# Altium project MD2084-R3M2E2.PrjPcb (part 1 of 3)
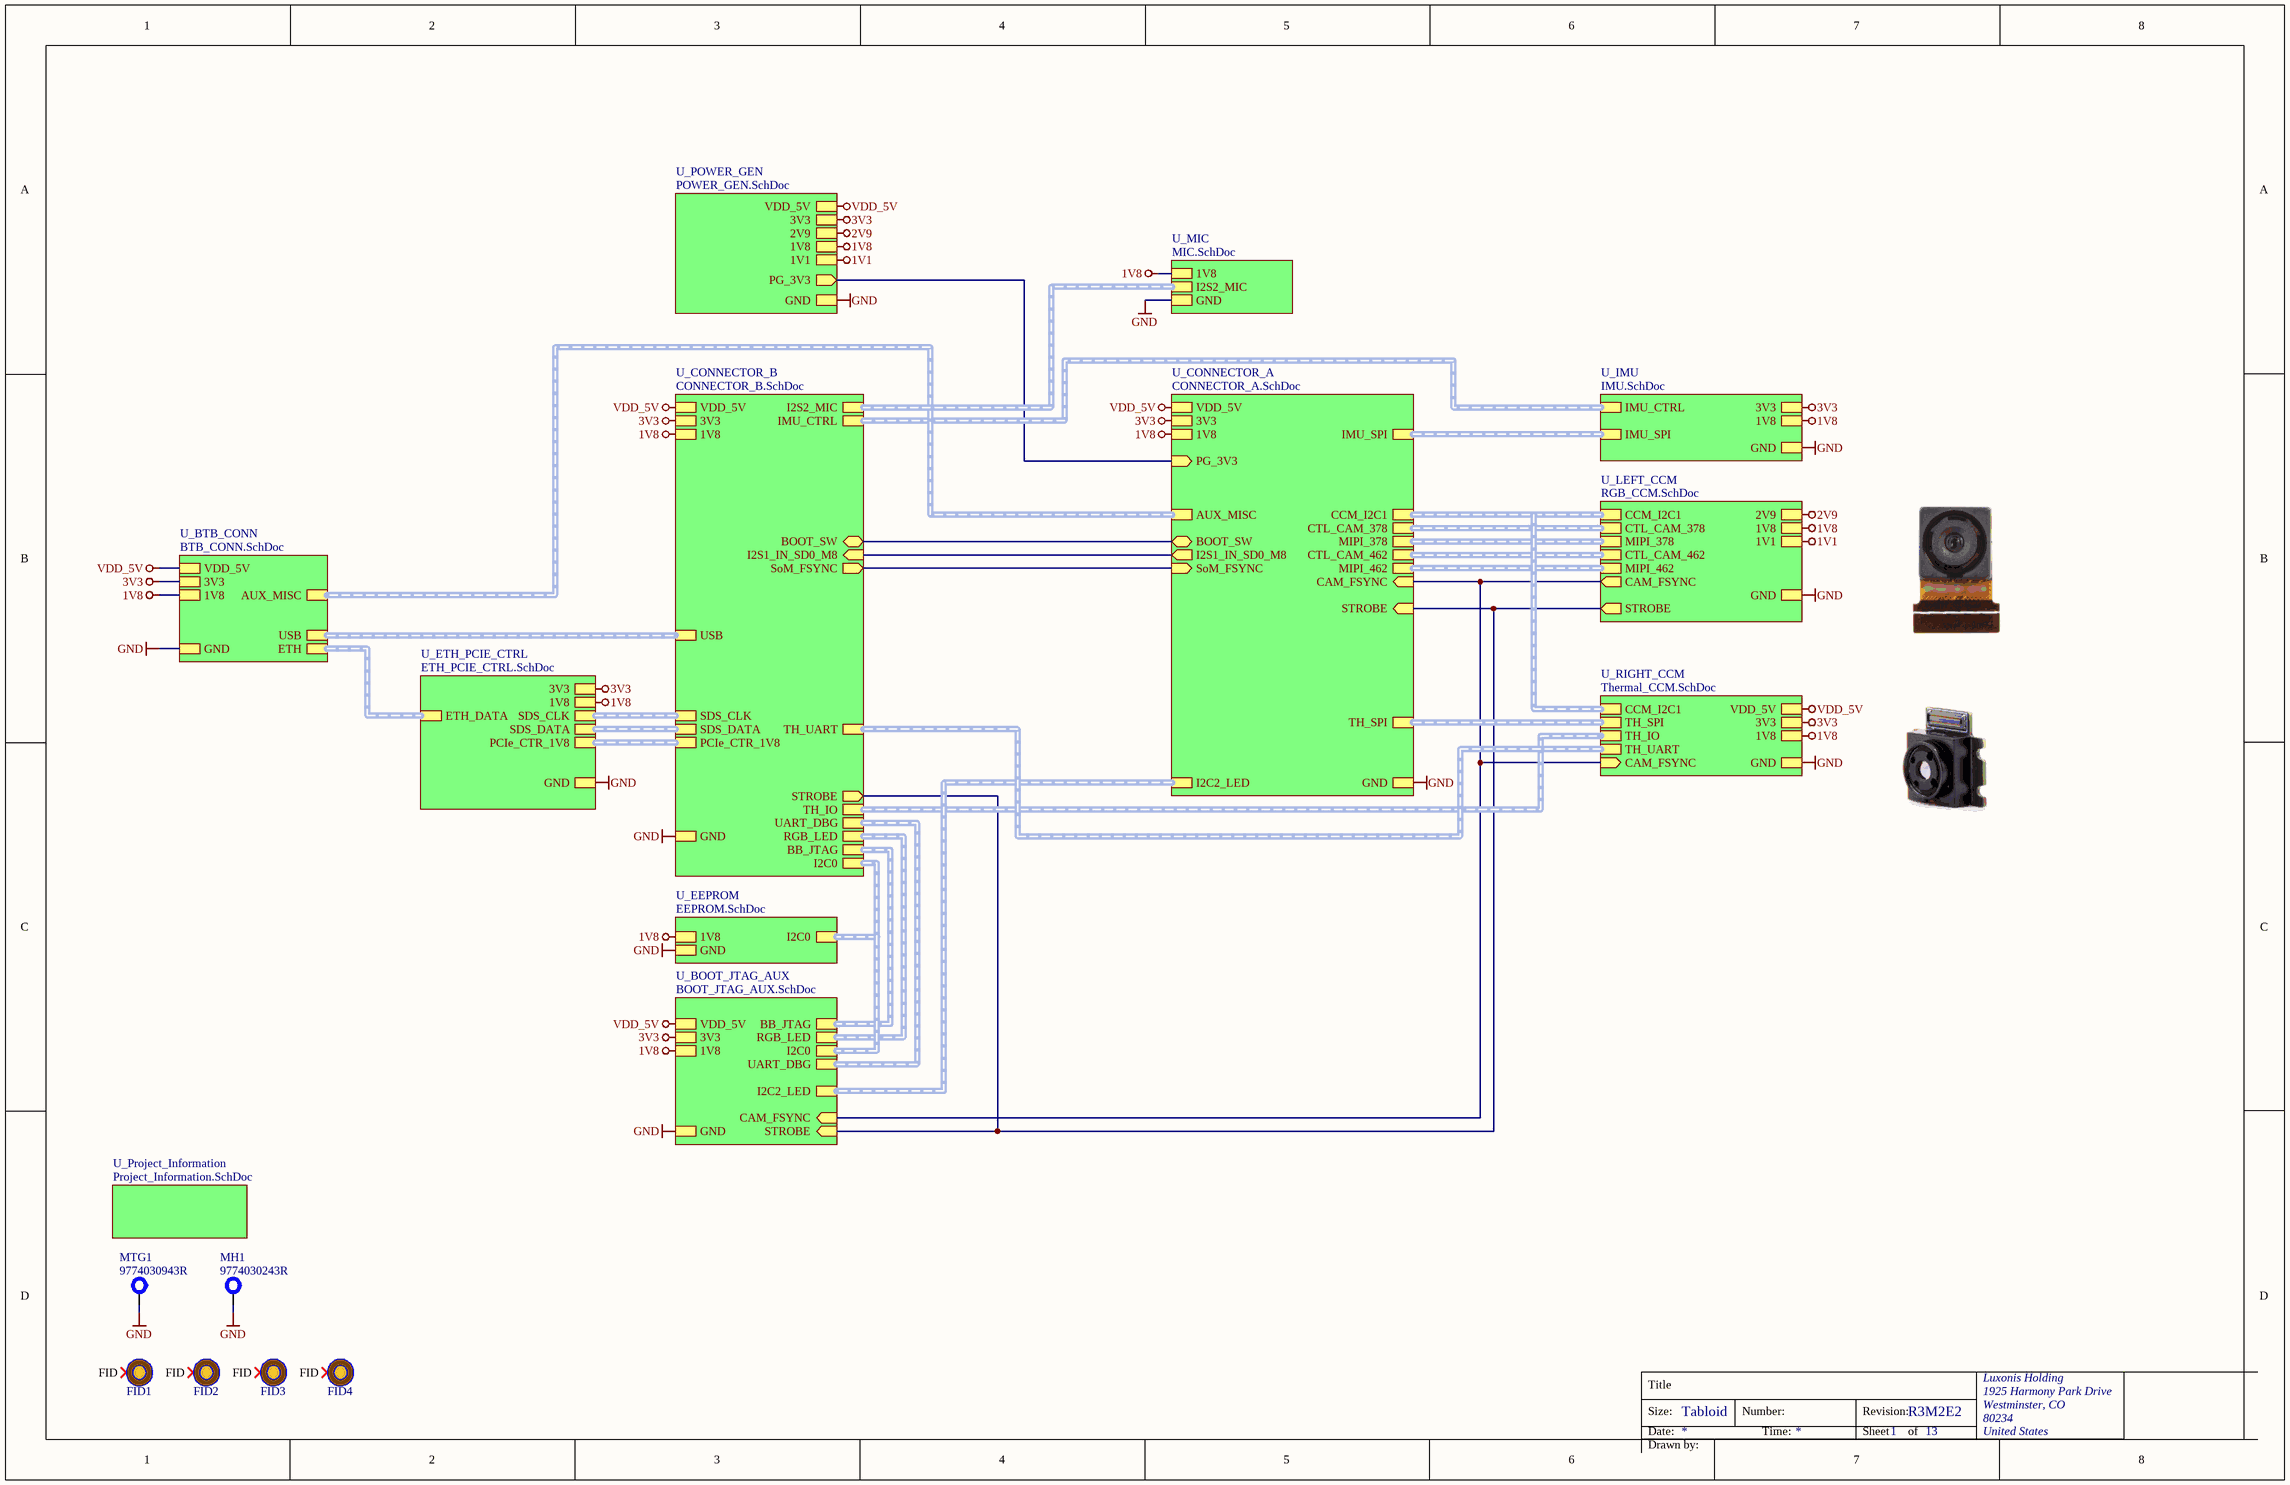
[diagram p0: TopLevel.SchDoc]
revision: R3M2E2; project_title: MD2084; drawn_by: Martin Debevc; document_number: D2088000
13 sheets, 246 parts. Net scope: strictly hierarchical (ports join the sheet entries above them; power ports are local).
Board file: MD2084.PcbDoc
Sheets:
  TopLevel.SchDoc
    U_Project_Information = Project_Information.SchDoc
    U_CONNECTOR_B = CONNECTOR_B.SchDoc
    U_CONNECTOR_A = CONNECTOR_A.SchDoc
    U_ETH_PCIE_CTRL = ETH_PCIE_CTRL.SchDoc
    U_BOOT_JTAG_AUX = BOOT_JTAG_AUX.SchDoc
    U_POWER_GEN = POWER_GEN.SchDoc
    U_RIGHT_CCM = Thermal_CCM.SchDoc
    U_LEFT_CCM = RGB_CCM.SchDoc
    U_IMU = IMU.SchDoc
    U_EEPROM = EEPROM.SchDoc
    U_BTB_CONN = BTB_CONN.SchDoc
    U_MIC = MIC.SchDoc

## Sheet TopLevel.SchDoc: =project_title
size Tabloid; CompanyName: Luxonis Holding; DrawnBy: Martin Debevc; Organization: Luxonis Holding; Address1: 1925 Harmony Park Drive; Address2: Westminster, CO; Address3: 80234; Address4: United States; DocumentNumber: D2088000; Revision: R3M2E2; SheetNumber: 1; SheetTotal: 13

### Parts
FID1  FIDUCIAL  [FIDUCIAL_ROUND_1MM]  (value not drawn)  (no BOM)
FID2  FIDUCIAL  [FIDUCIAL_ROUND_1MM]  (value not drawn)  (no BOM)
FID3  FIDUCIAL  [FIDUCIAL_ROUND_1MM]  (value not drawn)  (no BOM)
FID4  FIDUCIAL  [FIDUCIAL_ROUND_1MM]  (value not drawn)  (no BOM)
MH1  9774030243R  [9774030243R]
MTG1  9774030943R  [9774030943R]

### Sub-sheets
U_BOOT_JTAG_AUX = BOOT_JTAG_AUX.SchDoc: RGB_LED (harness RGB_LED), BB_JTAG (harness BB_JTAG), 1V8, 3V3, VDD_5V, STROBE (in), GND, I2C0 (harness I2C0), UART_DBG (harness UART_DEBUG), CAM_FSYNC (in), I2C2_LED (harness I2C2)
U_BTB_CONN = BTB_CONN.SchDoc: GND, VDD_5V, 3V3, USB (harness USB), 1V8, AUX_MISC (harness AUX_MISC), ETH (harness ETH_DATA)
U_CONNECTOR_A = CONNECTOR_A.SchDoc: GND, PG_3V3 (in), 3V3, 1V8, VDD_5V, MIPI_462 (harness MIPI_462), AUX_MISC (harness AUX_MISC), BOOT_SW (bidir), STROBE (in), CAM_FSYNC (in), IMU_SPI (harness IMU_SPI), TH_SPI (harness TH_SPI), CCM_I2C1 (harness I2C1), CTL_CAM_378 (harness CTL_CAM_378), MIPI_378 (harness MIPI_378), CTL_CAM_462 (harness CTL_CAM_462), I2S1_IN_SD0_M8 (out), I2C2_LED (harness I2C2), SoM_FSYNC (in)
U_CONNECTOR_B = CONNECTOR_B.SchDoc: VDD_5V, RGB_LED (harness RGB_LED), 1V8, GND, 3V3, I2C0 (harness I2C0), BB_JTAG (harness BB_JTAG), USB (harness USB), BOOT_SW (bidir), UART_DBG (harness UART_DEBUG), IMU_CTRL (harness IMU_CTRL), SDS_CLK (harness SDS_CLK), SDS_DATA (harness SDS_DATA), PCIe_CTR_1V8 (harness PCIe_CTR_1V8), I2S1_IN_SD0_M8 (in), TH_IO (harness TH_IO), STROBE (out), TH_UART (harness UART), I2S2_MIC (harness I2S2_MIC), SoM_FSYNC (out)
U_EEPROM = EEPROM.SchDoc: 1V8, GND, I2C0 (harness I2C0)
U_ETH_PCIE_CTRL = ETH_PCIE_CTRL.SchDoc: 3V3, GND, ETH_DATA (harness ETH_DATA), SDS_DATA (harness SDS_DATA), SDS_CLK (harness SDS_CLK), PCIe_CTR_1V8 (harness PCIe_CTR_1V8), 1V8
U_IMU = IMU.SchDoc: 3V3, 1V8, GND, IMU_SPI (harness IMU_SPI), IMU_CTRL (harness IMU_CTRL)
U_LEFT_CCM = RGB_CCM.SchDoc: GND, 1V8, 1V1, MIPI_462 (harness MIPI_462), MIPI_378 (harness MIPI_378), 2V9, STROBE (out), CTL_CAM_378 (harness CTL_CAM_RGB), CTL_CAM_462 (harness CTL_CAM_RGB), CAM_FSYNC (out), CCM_I2C1 (harness I2C1)
U_MIC = MIC.SchDoc: 1V8, GND, I2S2_MIC (harness I2S2_MIC)
U_POWER_GEN = POWER_GEN.SchDoc: GND, 3V3, 1V8, VDD_5V, 1V1, PG_3V3 (out), 2V9
U_Project_Information = Project_Information.SchDoc: no entries
U_RIGHT_CCM = Thermal_CCM.SchDoc: GND, 3V3, VDD_5V, 1V8, TH_SPI (harness TH_SPI), TH_IO (harness TH_IO), CCM_I2C1 (harness I2C1), TH_UART (harness UART), CAM_FSYNC (in)

### Nets
1V1: sheet U_POWER_GEN/1V1, sheet U_LEFT_CCM/1V1
1V8: sheet U_CONNECTOR_B/1V8, sheet U_CONNECTOR_A/1V8, sheet U_ETH_PCIE_CTRL/1V8, sheet U_BOOT_JTAG_AUX/1V8, sheet U_POWER_GEN/1V8, sheet U_RIGHT_CCM/1V8, sheet U_LEFT_CCM/1V8, sheet U_IMU/1V8, sheet U_EEPROM/1V8, sheet U_BTB_CONN/1V8, sheet U_MIC/1V8
2V9: sheet U_POWER_GEN/2V9, sheet U_LEFT_CCM/2V9
3V3: sheet U_CONNECTOR_B/3V3, sheet U_CONNECTOR_A/3V3, sheet U_ETH_PCIE_CTRL/3V3, sheet U_BOOT_JTAG_AUX/3V3, sheet U_POWER_GEN/3V3, sheet U_RIGHT_CCM/3V3, sheet U_IMU/3V3, sheet U_BTB_CONN/3V3
GND: MH1.1 MTG1.1 ; sheet U_CONNECTOR_B/GND, sheet U_CONNECTOR_A/GND, sheet U_ETH_PCIE_CTRL/GND, sheet U_BOOT_JTAG_AUX/GND, sheet U_POWER_GEN/GND, sheet U_RIGHT_CCM/GND, sheet U_LEFT_CCM/GND, sheet U_IMU/GND, sheet U_EEPROM/GND, sheet U_BTB_CONN/GND, sheet U_MIC/GND
VDD_5V: sheet U_CONNECTOR_B/VDD_5V, sheet U_CONNECTOR_A/VDD_5V, sheet U_BOOT_JTAG_AUX/VDD_5V, sheet U_POWER_GEN/VDD_5V, sheet U_RIGHT_CCM/VDD_5V, sheet U_BTB_CONN/VDD_5V
BOOT_SW: sheet U_CONNECTOR_B/BOOT_SW, sheet U_CONNECTOR_A/BOOT_SW
CAM_FSYNC: sheet U_CONNECTOR_A/CAM_FSYNC, sheet U_BOOT_JTAG_AUX/CAM_FSYNC, sheet U_RIGHT_CCM/CAM_FSYNC, sheet U_LEFT_CCM/CAM_FSYNC
I2S1_IN_SD0_M8: sheet U_CONNECTOR_B/I2S1_IN_SD0_M8, sheet U_CONNECTOR_A/I2S1_IN_SD0_M8
PG_3V3: sheet U_CONNECTOR_A/PG_3V3, sheet U_POWER_GEN/PG_3V3
SoM_FSYNC: sheet U_CONNECTOR_B/SoM_FSYNC, sheet U_CONNECTOR_A/SoM_FSYNC
STROBE: sheet U_CONNECTOR_B/STROBE, sheet U_CONNECTOR_A/STROBE, sheet U_BOOT_JTAG_AUX/STROBE, sheet U_LEFT_CCM/STROBE

Not connected (* = marked no-connect by the designer): FID1 FID*; FID2 FID*; FID3 FID*; FID4 FID*

### Buses and harness runs
harness sheet U_BOOT_JTAG_AUX/BB_JTAG = sheet U_CONNECTOR_B/BB_JTAG
harness sheet U_BOOT_JTAG_AUX/I2C0 = sheet U_CONNECTOR_B/I2C0 = sheet U_EEPROM/I2C0
harness sheet U_BOOT_JTAG_AUX/I2C2_LED = sheet U_CONNECTOR_A/I2C2_LED
harness sheet U_BOOT_JTAG_AUX/RGB_LED = sheet U_CONNECTOR_B/RGB_LED
harness sheet U_BOOT_JTAG_AUX/UART_DBG = sheet U_CONNECTOR_B/UART_DBG
harness sheet U_BTB_CONN/AUX_MISC = sheet U_CONNECTOR_A/AUX_MISC
harness sheet U_BTB_CONN/ETH = sheet U_ETH_PCIE_CTRL/ETH_DATA
harness sheet U_BTB_CONN/USB = sheet U_CONNECTOR_B/USB
harness sheet U_CONNECTOR_A/CCM_I2C1 = sheet U_LEFT_CCM/CCM_I2C1 = sheet U_RIGHT_CCM/CCM_I2C1
harness sheet U_CONNECTOR_A/CTL_CAM_378 = sheet U_LEFT_CCM/CTL_CAM_378
harness sheet U_CONNECTOR_A/CTL_CAM_462 = sheet U_LEFT_CCM/CTL_CAM_462
harness sheet U_CONNECTOR_A/IMU_SPI = sheet U_IMU/IMU_SPI
harness sheet U_CONNECTOR_A/MIPI_378 = sheet U_LEFT_CCM/MIPI_378
harness sheet U_CONNECTOR_A/MIPI_462 = sheet U_LEFT_CCM/MIPI_462
harness sheet U_CONNECTOR_A/TH_SPI = sheet U_RIGHT_CCM/TH_SPI
harness sheet U_CONNECTOR_B/I2S2_MIC = sheet U_MIC/I2S2_MIC
harness sheet U_CONNECTOR_B/IMU_CTRL = sheet U_IMU/IMU_CTRL
harness sheet U_CONNECTOR_B/PCIe_CTR_1V8 = sheet U_ETH_PCIE_CTRL/PCIe_CTR_1V8
harness sheet U_CONNECTOR_B/SDS_CLK = sheet U_ETH_PCIE_CTRL/SDS_CLK
harness sheet U_CONNECTOR_B/SDS_DATA = sheet U_ETH_PCIE_CTRL/SDS_DATA
harness sheet U_CONNECTOR_B/TH_IO = sheet U_RIGHT_CCM/TH_IO
harness sheet U_CONNECTOR_B/TH_UART = sheet U_RIGHT_CCM/TH_UART

### Notes on the sheet
- Title
- Size:
- Date:
- Tabloid
- Number:
- Time:
- Revision:
- Sheet
- of
- Drawn by:

### Library data of the parts
FID1-FID4 = CMP-011-000000-4: Fiducial with various available footprints; Manufacturer Part Number 1: /
MH1 = CMP-014-000015-1: MP ROUND STANDOFF M2X0.4 STEEL 3MM; Manufacturer 1: Wurth Electronics; Plating: Tin; Outside Diameter: 0.171inch; Threaded/Unthreaded: Threaded; RoHS: Yes; Pricing 1: 1=0.95000, 10=0.91800, 50=0.79500, 100=0.73900 (USD); ComponentLink1URL: http://www.mouser.com/ds/2/445/9774030243R-611455.pdf?src-supplier=Mouser; ComponentLink1Description: http://www.mouser.com/ds/2/445/9774030243R-611455.pdf?src-supplier=Mouser; Material: Steel; REACH SVHC: Unknown; Length: 0.173inch; ComponentLink4Description: http://www.farnell.com/datasheets/1960368.pdf?src-supplier=Newark; ComponentLink3Description: https://katalog.we-online.de/em/datasheet/9774030243R.pdf?src-supplier=Digi-Key; Stock 1: 20568; ComponentLink5URL: http://www.farnell.com/datasheets/1960368.pdf?src-supplier=Element14; ComponentLink3URL: https://katalog.we-online.de/em/datasheet/9774030243R.pdf?src-supplier=Digi-Key; ComponentLink2Description: http://www.farnell.com/datasheets/1960368.pdf?src-supplier=Farnell; ComponentLink4URL: http://www.farnell.com/datasheets/1960368.pdf?src-supplier=Newark; Source: LuxonisMaster.SchLib; Manufacturer Part Number 1: 9774030243R; Design Item ID: 9774030243R; ComponentLink2URL: http://www.farnell.com/datasheets/1960368.pdf?src-supplier=Farnell; ComponentLink5Description: http://www.farnell.com/datasheets/1960368.pdf?src-supplier=Element14
MTG1 = CMP-090-000000-4: Spacers/Standoffs; Manufacturer 1: Wurth Electronics; Manufacturer Part Number 1: 9774030943R

## Sheet Project_Information.SchDoc: =project_title
size Tabloid; CompanyName: Luxonis Holding; DrawnBy: Martin Debevc; Organization: Luxonis Holding; Address1: 1925 Harmony Park Drive; Address2: Westminster, CO; Address3: 80234; Address4: United States; DocumentNumber: D2088000; Revision: R3M2E2; SheetNumber: 2; SheetTotal: 13
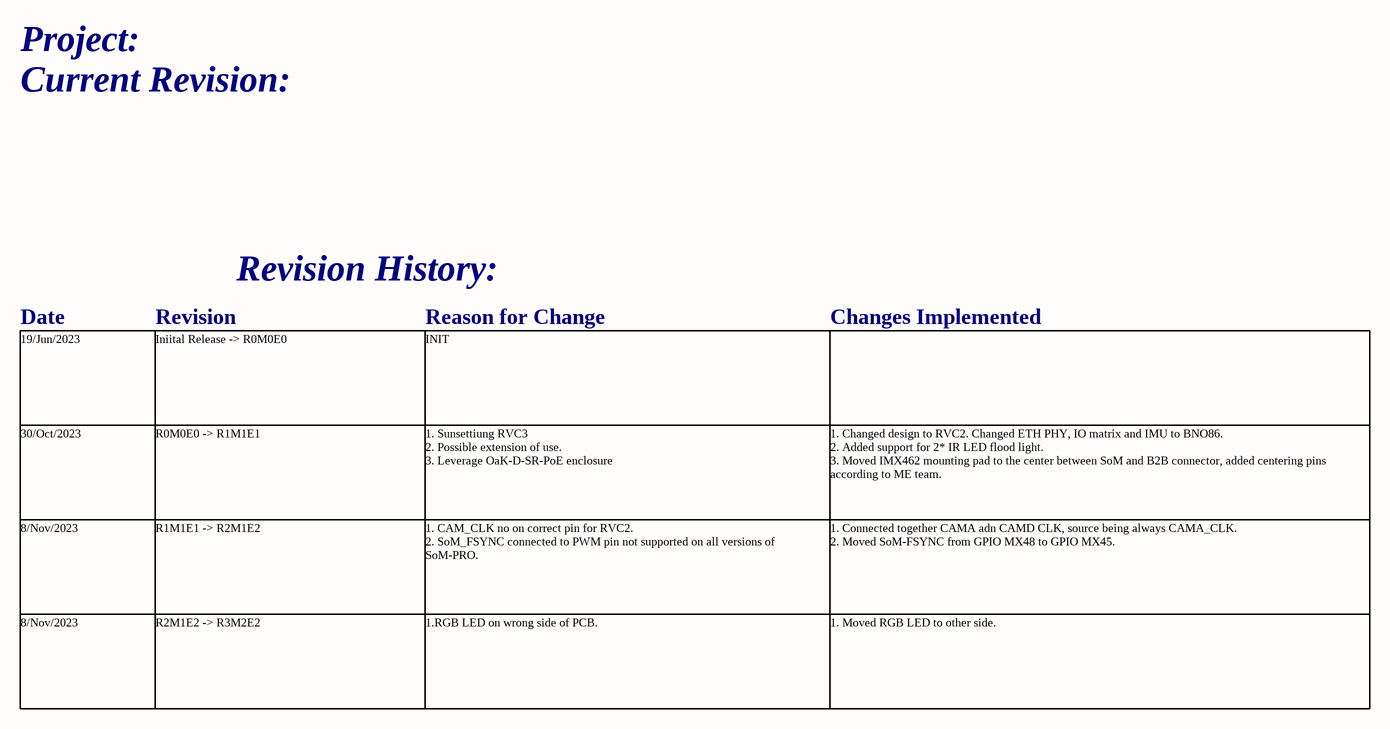
[diagram p1: Project_Information.SchDoc]

### Notes on the sheet
- Project:
- Current Revision:
- Revision History:
- Date
- Revision
- Reason for Change
- Changes Implemented
- 19/Jun/2023
- Iniital Release -> R0M0E0
- INIT
- 30/Oct/2023
- R0M0E0 -> R1M1E1
- 1. Sunsettiung RVC3
  2. Possible extension of use.
  3. Leverage OaK-D-SR-PoE enclosure
- 1. Changed design to RVC2. Changed ETH PHY, IO matrix and IMU to BNO86.
  2. Added support for 2* IR LED flood light.
  3. Moved IMX462 mounting pad to the center between SoM and B2B connector, added centering pins according to ME team.
- 8/Nov/2023
- R1M1E1 -> R2M1E2
- 1. CAM_CLK no on correct pin for RVC2.
  2. SoM_FSYNC connected to PWM pin not supported on all versions of SoM-PRO.
- 1. Connected together CAMA adn CAMD CLK, source being always CAMA_CLK.
  2. Moved SoM-FSYNC from GPIO MX48 to GPIO MX45.
- R2M1E2 -> R3M2E2
- 1.RGB LED on wrong side of PCB.
- 1. Moved RGB LED to other side.
- Title
- Size:
- Date:
- Tabloid
- Number:
- Time:
- Revision:
- Sheet
- of
- Drawn by:

## Sheet CONNECTOR_B.SchDoc: =project_title
size Tabloid; CompanyName: Luxonis Holding; DrawnBy: Martin Debevc; Organization: Luxonis Holding; Address1: 1925 Harmony Park Drive; Address2: Westminster, CO; Address3: 80234; Address4: United States; DocumentNumber: D2088000; Revision: R3M2E2; SheetNumber: 6; SheetTotal: 13
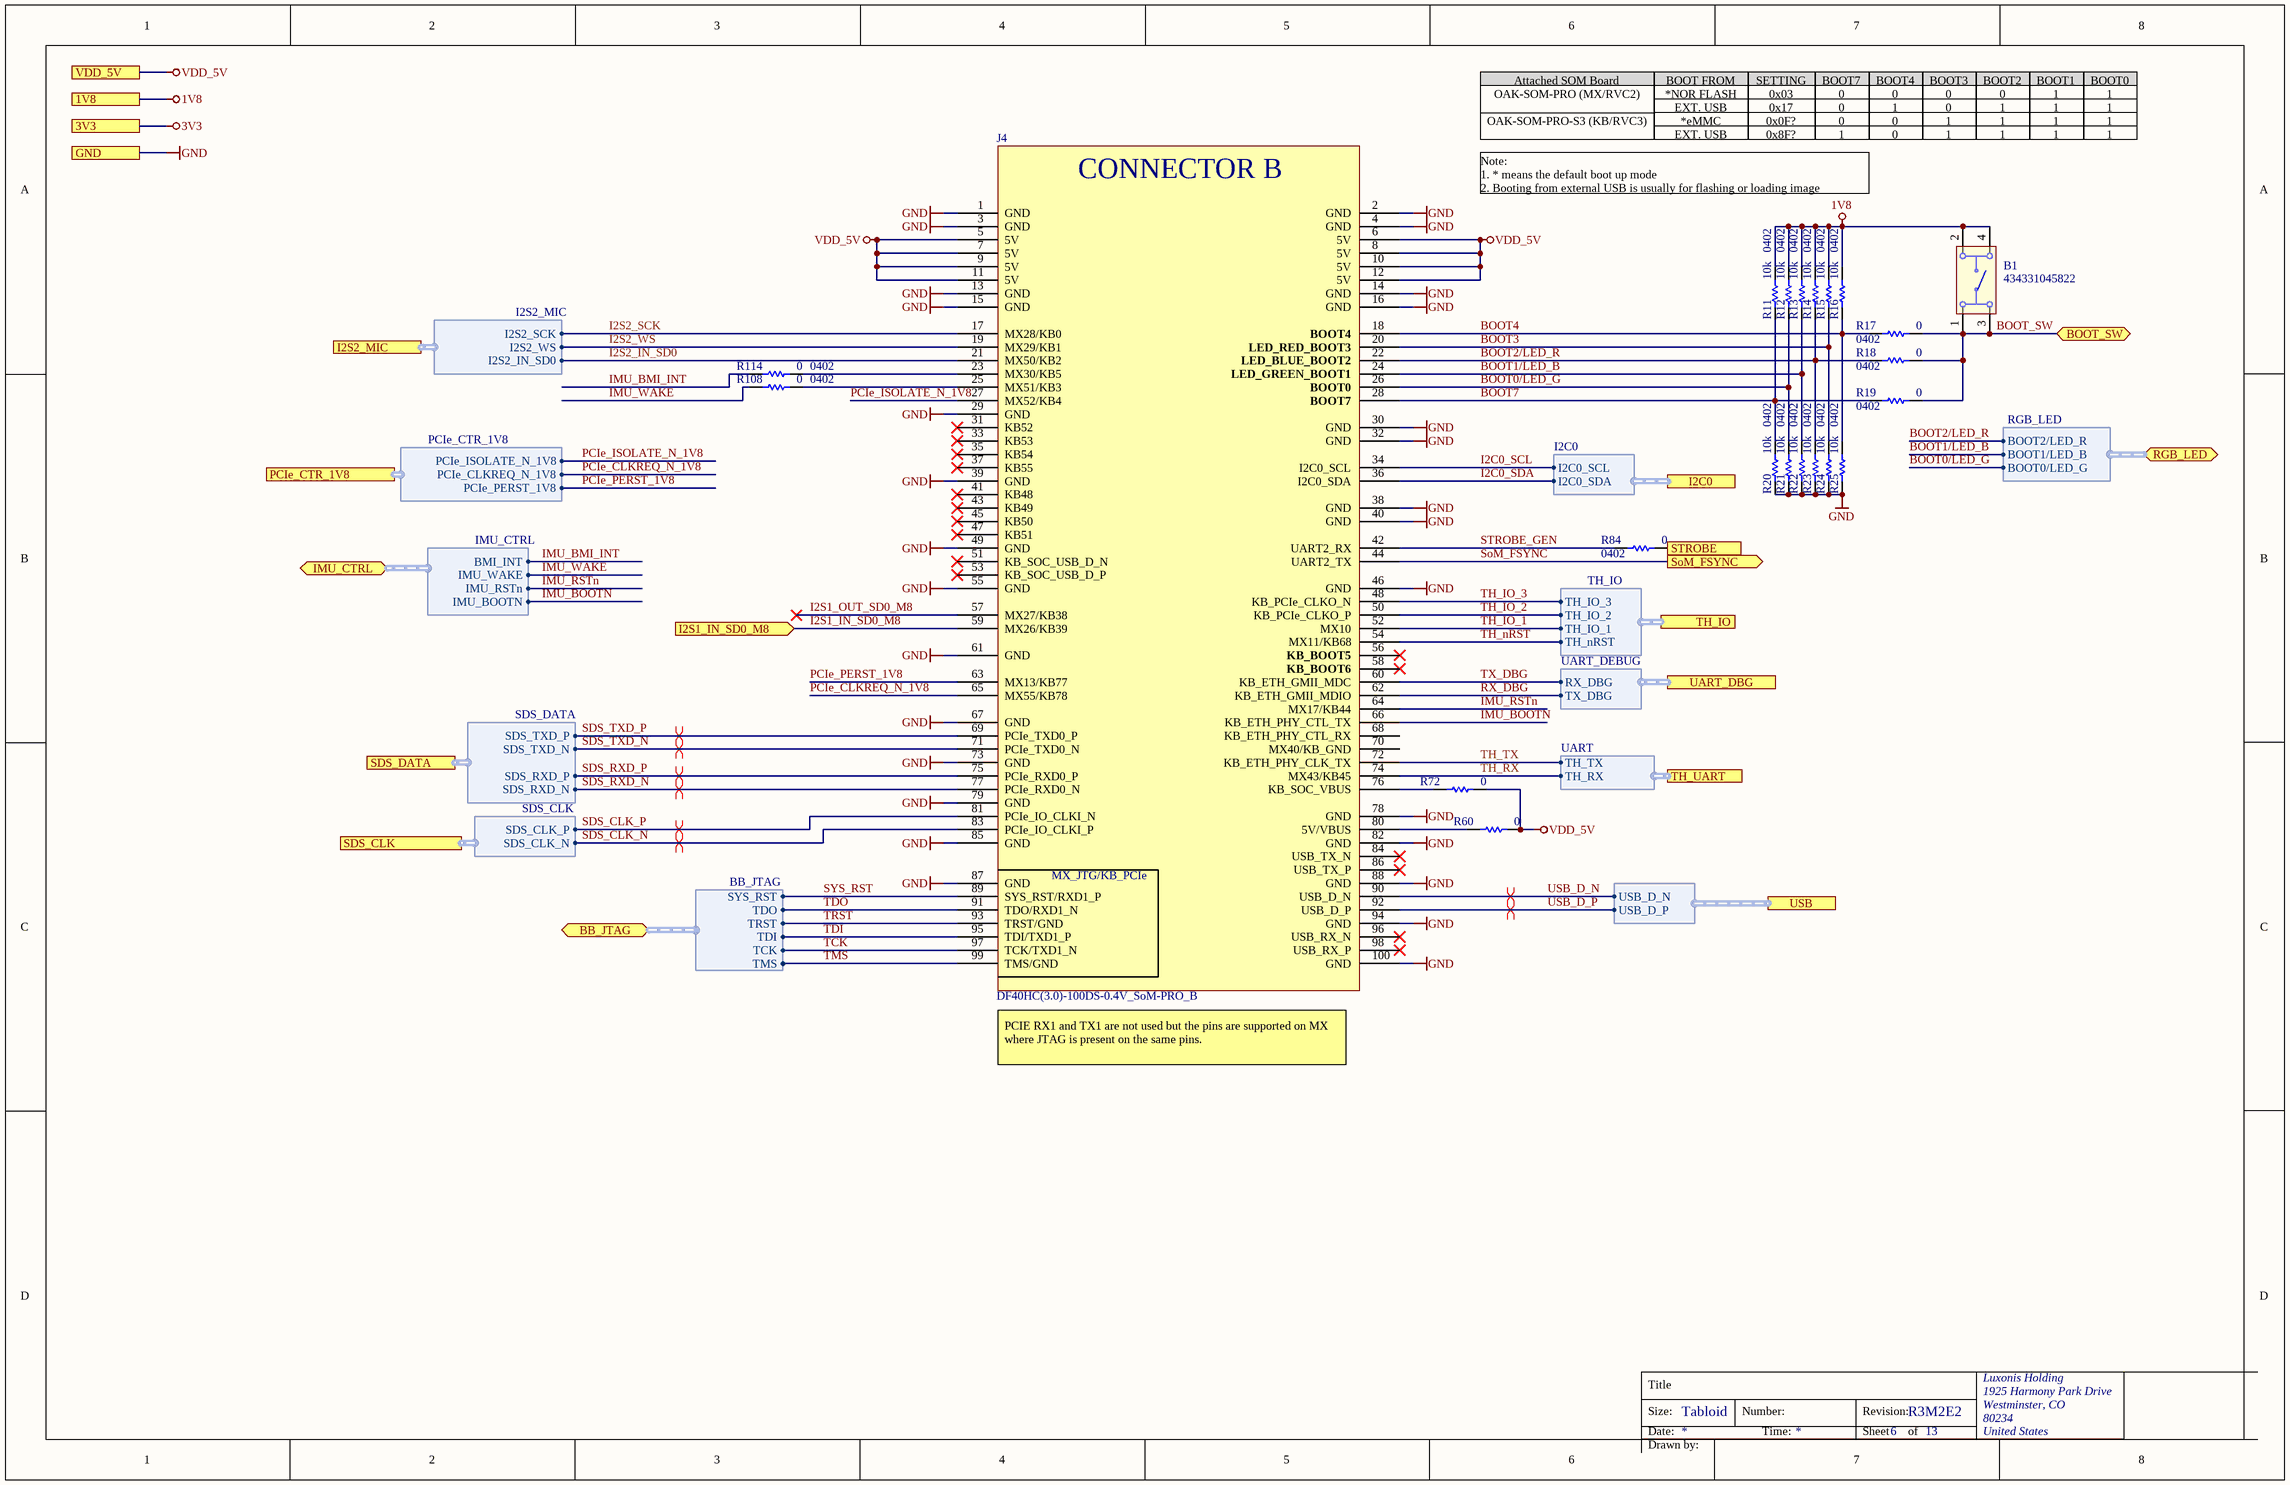
[diagram p2: CONNECTOR_B.SchDoc]

### Parts
B1  434331045822  [434331045822]
J4  DF40HC(3.0)-100DS-0.4V_SoM-PRO_B  [CON_B_BW2099_SoM_DF40HC-3.0-100DS-0.4V_minpad]
R11  value 10k  Case/Package: 0402  [RESC0402(1005)_N]  (hidden comment: RC0402FR-1310KL)
R12  value 10k  Case/Package: 0402  [RESC0402(1005)_N]  (hidden comment: RC0402FR-1310KL)
R13  value 10k  Case/Package: 0402  [RESC0402(1005)_N]  (hidden comment: RC0402FR-1310KL)
R14  value 10k  Case/Package: 0402  [RESC0402(1005)_N]  (hidden comment: RC0402FR-1310KL)
R15  value 10k  Case/Package: 0402  [RESC0402(1005)_N]  (hidden comment: RC0402FR-1310KL)
R16  value 10k  Case/Package: 0402  [RESC0402(1005)_N]  (hidden comment: RC0402FR-1310KL)
R17  value 0  Case/Package: 0402  [RESC0402(1005)_L]  (hidden comment: CRCW04020000Z0ED)
R18  value 0  Case/Package: 0402  [RESC0402(1005)_L]  (hidden comment: CRCW04020000Z0ED)
R19  value 0  Case/Package: 0402  [RESC0402(1005)_L]  (hidden comment: CRCW04020000Z0ED)
R20  value 10k  Case/Package: 0402  [RESC0402(1005)_N]  (hidden comment: RC0402FR-1310KL)
R21  value 10k  Case/Package: 0402  [RESC0402(1005)_N]  (hidden comment: RC0402FR-1310KL)
R22  value 10k  Case/Package: 0402  [RESC0402(1005)_N]  (hidden comment: RC0402FR-1310KL)
R23  value 10k  Case/Package: 0402  [RESC0402(1005)_N]  (hidden comment: RC0402FR-1310KL)
R24  value 10k  Case/Package: 0402  [RESC0402(1005)_N]  (hidden comment: RC0402FR-1310KL)
R25  value 10k  Case/Package: 0402  [RESC0402(1005)_N]  (hidden comment: RC0402FR-1310KL)
R60  value 0  [RESC0402(1005)_L]  (hidden comment: CRCW04020000Z0ED)
R72  value 0  [RESC0402(1005)_L]  (hidden comment: CRCW04020000Z0ED)
R84  value 0  Case/Package: 0402  [RESC0402(1005)_L]  (hidden comment: CRCW04020000Z0ED)
R108  value 0  Case/Package: 0402  [RESC0402(1005)_L]  (hidden comment: CRCW04020000Z0ED)
R114  value 0  Case/Package: 0402  [RESC0402(1005)_L]  (hidden comment: CRCW04020000Z0ED)

### Ports
1V8, 3V3, BB_JTAG (bidir, harness BB_JTAG), BOOT_SW (bidir), GND, I2C0 (harness I2C0), I2S1_IN_SD0_M8 (in), I2S2_MIC (harness I2S2_MIC), IMU_CTRL (bidir, harness IMU_CTRL), PCIe_CTR_1V8 (harness PCIe_CTR_1V8), RGB_LED (bidir, harness RGB_LED), SDS_CLK (harness SDS_CLK), SDS_DATA (harness SDS_DATA), SoM_FSYNC (out), STROBE (out), TH_IO (harness TH_IO), TH_UART (harness UART), UART_DBG (harness UART_DEBUG), USB (harness USB), VDD_5V

### Harnesses
I2C0: I2C0_SDA, I2C0_SCL
BB_JTAG: SYS_RST, TDO, TRST, TDI, TCK, TMS
RGB_LED: BOOT2/LED_R, BOOT1/LED_B, BOOT0/LED_G
USB: USB_D_P, USB_D_N
I2S2_MIC: I2S2_SCK, I2S2_WS, I2S2_IN_SD0
UART_DEBUG: RX_DBG, TX_DBG
SDS_DATA: SDS_TXD_P, SDS_TXD_N, SDS_RXD_P, SDS_RXD_N
SDS_CLK: SDS_CLK_P, SDS_CLK_N
PCIe_CTR_1V8: PCIe_CLKREQ_N_1V8, PCIe_ISOLATE_N_1V8, PCIe_PERST_1V8
TH_IO: TH_IO_3, TH_IO_2, TH_IO_1, TH_nRST
UART: TH_RX, TH_TX
IMU_CTRL: BMI_INT, IMU_WAKE, IMU_RSTn, IMU_BOOTN

### Nets
1V8: B1.2 B1.4 R11.2 R12.2 R13.2 R14.2 R15.2 R16.2 ; port 1V8
GND: J4.1(GND) J4.2(GND) J4.3(GND) J4.4(GND) J4.13(GND) J4.14(GND) J4.15(GND) J4.16(GND) J4.29(GND) J4.30(GND) J4.32(GND) J4.38(GND) J4.39(GND) J4.40(GND) J4.46(GND) J4.49(GND) J4.55(GND) J4.61(GND) J4.67(GND) J4.73(GND) J4.78(GND) J4.79(GND) J4.82(GND) J4.85(GND) J4.87(GND) J4.88(GND) J4.94(GND) J4.100(GND) R20.1 R21.1 R22.1 R23.1 R24.1 R25.1 ; port GND
VDD_5V: J4.5(5V) J4.6(5V) J4.7(5V) J4.8(5V) J4.9(5V) J4.10(5V) J4.11(5V) J4.12(5V) R60.2 R72.2 ; port VDD_5V
BOOT0/LED_G: J4.26(BOOT0) R12.1 R21.2 ; port RGB_LED.BOOT0/LED_G
BOOT1/LED_B: J4.24(LED_GREEN_BOOT1) R13.1 R22.2 ; port RGB_LED.BOOT1/LED_B
BOOT2/LED_R: J4.22(LED_BLUE_BOOT2) R14.1 R18.1 R23.2 ; port RGB_LED.BOOT2/LED_R
BOOT3: J4.20(LED_RED_BOOT3) R15.1 R24.2
BOOT4: J4.18(BOOT4) R16.1 R17.1 R25.2
BOOT7: J4.28(BOOT7) R11.1 R19.1 R20.2
BOOT_SW: B1.1 B1.3 R17.2 R18.2 R19.2 ; port BOOT_SW
I2C0_SCL: J4.34(I2C0_SCL) ; port I2C0.I2C0_SCL
I2C0_SDA: J4.36(I2C0_SDA) ; port I2C0.I2C0_SDA
I2S1_IN_SD0_M8: J4.59(MX26/KB39) ; port I2S1_IN_SD0_M8
I2S1_OUT_SD0_M8: J4.57(MX27/KB38)
I2S2_IN_SD0: J4.21(MX50/KB2) ; port I2S2_MIC.I2S2_IN_SD0
I2S2_SCK: J4.17(MX28/KB0) ; port I2S2_MIC.I2S2_SCK
I2S2_WS: J4.19(MX29/KB1) ; port I2S2_MIC.I2S2_WS
IMU_BMI_INT: R114.1 ; port IMU_CTRL.BMI_INT
IMU_BOOTN: J4.66(KB_ETH_PHY_CTL_TX) ; port IMU_CTRL.IMU_BOOTN
IMU_RSTn: J4.64(MX17/KB44) ; port IMU_CTRL.IMU_RSTn
IMU_WAKE: R108.1 ; port IMU_CTRL.IMU_WAKE
PCIe_CLKREQ_N_1V8: J4.65(MX55/KB78) ; port PCIe_CTR_1V8.PCIe_CLKREQ_N_1V8
PCIe_ISOLATE_N_1V8: J4.27(MX52/KB4) ; port PCIe_CTR_1V8.PCIe_ISOLATE_N_1V8
PCIe_PERST_1V8: J4.63(MX13/KB77) ; port PCIe_CTR_1V8.PCIe_PERST_1V8
RX_DBG: J4.62(KB_ETH_GMII_MDIO) ; port UART_DBG.TX_DBG
SDS_CLK_N: J4.83(PCIe_IO_CLKI_P) ; port SDS_CLK.SDS_CLK_N
SDS_CLK_P: J4.81(PCIe_IO_CLKI_N) ; port SDS_CLK.SDS_CLK_P
SDS_RXD_N: J4.77(PCIe_RXD0_N) ; port SDS_DATA.SDS_RXD_N
SDS_RXD_P: J4.75(PCIe_RXD0_P) ; port SDS_DATA.SDS_RXD_P
SDS_TXD_N: J4.71(PCIe_TXD0_N) ; port SDS_DATA.SDS_TXD_N
SDS_TXD_P: J4.69(PCIe_TXD0_P) ; port SDS_DATA.SDS_TXD_P
SoM_FSYNC: J4.44(UART2_TX) ; port SoM_FSYNC
STROBE: R84.2 ; port STROBE
STROBE_GEN: J4.42(UART2_RX) R84.1
SYS_RST: J4.89(SYS_RST/RXD1_P) ; port BB_JTAG.SYS_RST
TCK: J4.97(TCK/TXD1_N) ; port BB_JTAG.TCK
TDI: J4.95(TDI/TXD1_P) ; port BB_JTAG.TDI
TDO: J4.91(TDO/RXD1_N) ; port BB_JTAG.TDO
TH_IO_1: J4.52(MX10) ; port TH_IO.TH_IO_1
TH_IO_2: J4.50(KB_PCIe_CLKO_P) ; port TH_IO.TH_IO_2
TH_IO_3: J4.48(KB_PCIe_CLKO_N) ; port TH_IO.TH_IO_3
TH_nRST: J4.54(MX11/KB68) ; port TH_IO.TH_nRST
TH_RX: J4.74(MX43/KB45) ; port TH_UART.TH_RX
TH_TX: J4.72(KB_ETH_PHY_CLK_TX) ; port TH_UART.TH_TX
TMS: J4.99(TMS/GND) ; port BB_JTAG.TMS
TRST: J4.93(TRST/GND) ; port BB_JTAG.TRST
TX_DBG: J4.60(KB_ETH_GMII_MDC) ; port UART_DBG.RX_DBG
USB_D_N: J4.90(USB_D_N) ; port USB.USB_D_N
USB_D_P: J4.92(USB_D_P) ; port USB.USB_D_P
NetJ4_23: J4.23(MX30/KB5) R114.2
NetJ4_25: J4.25(MX51/KB3) R108.2
NetJ4_76: J4.76(KB_SOC_VBUS) R72.1
NetJ4_80: J4.80(5V/VBUS) R60.1

Not connected (* = marked no-connect by the designer): J4 31(KB52)* 33(KB53)* 35(KB54)* 37(KB55)* 41(KB48)* 43(KB49)* 45(KB50)* 47(KB51)* 51(KB_SOC_USB_D_N)* 53(KB_SOC_USB_D_P)* 56(KB_BOOT5)* 58(KB_BOOT6)* 68(KB_ETH_PHY_CTL_RX) 70(MX40/KB_GND) 84(USB_TX_N)* 86(USB_TX_P)* 96(USB_RX_N)* 98(USB_RX_P)*

### Layout directives
differential pair; net class USB2; differential pair class 90ohm: USB_D_N, USB_D_P
differential pair; net class PCIE; differential pair class 100ohm: SDS_CLK_N, SDS_CLK_P, SDS_RXD_N, SDS_RXD_P, SDS_TXD_N, SDS_TXD_P

### Notes on the sheet
- Attached SOM Board
- BOOT FROM
- *NOR FLASH
- SETTING
- 0x03
- BOOT7
- 0
- BOOT4
- BOOT3
- BOOT2
- BOOT1
- 1
- BOOT0
- OAK-SOM-PRO-S3 (KB/RVC3)
- OAK-SOM-PRO (MX/RVC2)
- EXT. USB
- *eMMC
- 0x17
- 0x0F?
- 0x8F?
- Note:
  1. * means the default boot up mode
  2. Booting from external USB is usually for flashing or loading image
- (near J4) PCIE RX1 and TX1 are not used but the pins are supported on MX where JTAG is present on the same pins.
- Title
- Size:
- Date:
- Tabloid
- Number:
- Time:
- Revision:
- Sheet
- of
- Drawn by:
- (in symbol CMP-002-00155-7) CONNECTOR B; MX_JTG/KB_PCIe

### Library data of the parts
B1 = CMP-011-00016-3: Keypad Switch, 1 Switches, SPST, Momentary-tactile, 0.05A, 12VDC, 2.65N, Solder Terminal, Surface Mount-right Angle; Manufacturer 1: Wurth Electronics; Voltage Rating: 12V; Max Current Rating: 50mA; Throw Configuration: SPST-NO; Manufacturer part number 1: 434331045822; Supplier Part Number 1: 732-7055-2-ND; Pins: 4; Supplier 1: Digi-Key; Current Rating: 50mA; Mounting Technology: SMD; Case/Package: 434331045822
J4 = CMP-002-00155-7: OAK-SoM-Pro_S2/S3 base board conn. B; Manufacturer 1: Hirose; Manufacturer Part Number 1: DF40HC(3.0)-100DS-0.4V(58); Gender: Female; Number of Positions: 100; Connector Type: Receptacle; System: Connector; Pitch: 0.016inch; Contact Plating: Gold; Stock 2: 2078; ComponentLink4URL: https://datasheet.ciiva.com/18562/ed-df40-20140305-18562462.pdf?src-supplier=Digi-Key; ComponentLink1Description: https://datasheet.ciiva.com/46636/ed-df40-20140305-46636517.pdf?src-supplier=Digi-Key; Source: LuxonisMaster.SchLib; Lead Free: Lead Free; Mounting Technology: SMT; Pricing 2: 1=2.50000, 10=2.40000, 25=2.10000, 50=2.10000, 100=2.00000, 250=1.76000, 500=1.71000, 1000=1.45000, 2000=1.36000, 5000=1.31000, 10000=1.31000 (USD); ComponentLink2Description: https://datasheet.ciiva.com/18562/ed-df40-20140305-18562189.pdf?src-supplier=Digi-Key; RoHS: Yes; Design Item ID: DF40HC(3.0)-100DS-0.4V_SoM-PRO_B; Pricing 1: 1=2.54000, 10=2.26000, 25=2.07000, 50=2.07000, 100=1.98000, 250=1.79000, 500=1.65000, 1000=1.41000, 3000=1.32000, 6000=1.23000, 10000=1.23000 (USD); ComponentLink3URL: https://datasheet.ciiva.com/13559/ed-df40-20140305-13559540.pdf?src-supplier=Mouser; Mount: Surface Mount; ComponentLink2URL: https://datasheet.ciiva.com/18562/ed-df40-20140305-18562189.pdf?src-supplier=Digi-Key; Packaging: Tape and Reel; Stock 1: 2172; ComponentLink1URL: https://datasheet.ciiva.com/46636/ed-df40-20140305-46636517.pdf?src-supplier=Digi-Key; Package Quantity: 1000; Pins: 100; Number of Rows: 2; ComponentLink3Description: https://datasheet.ciiva.com/13559/ed-df40-20140305-13559540.pdf?src-supplier=Mouser; ComponentLink4Description: https://datasheet.ciiva.com/18562/ed-df40-20140305-18562462.pdf?src-supplier=Digi-Key
R11-R16 R20-R25 = CMP-115-000004-8: RES SMD 10K OHM 1% 1/16W 0402; Manufacturer 1: Yageo; Power Rating: 62.5mW; Temperature Coefficient: 100ppm/°C; Voltage Rating: 50V; Min Operating Temperature: -55°C; Max Operating Temperature: 155°C; Design Item ID: RC0402FR-1310KL; Tolerance: 1%; Manufacturer Part Number 1: RC0402FR-1310KL
R17-R19 R60 R72 R84 R108 R114 = CMP-013-000022-11: RES SMD 0 OHM 5% 1/16W 0402; Manufacturer 1: Vishay; Voltage Rating: 50V; Power Rating: 63mW; Max Operating Temperature: 155°C; Manufacturer Part Number 1: CRCW04020000Z0ED; Tolerance: 5%; Min Operating Temperature: -55°C; Design Item ID: CRCW04020000Z0ED
  R60 R72: Case/Package: 0402

## Sheet CONNECTOR_A.SchDoc: =project_title
size Tabloid; CompanyName: Luxonis Holding; DrawnBy: Martin Debevc; Organization: Luxonis Holding; Address1: 1925 Harmony Park Drive; Address2: Westminster, CO; Address3: 80234; Address4: United States; DocumentNumber: D2088000; Revision: R3M2E2; SheetNumber: 5; SheetTotal: 13
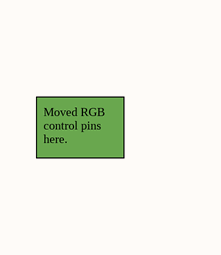
[diagram p3: CONNECTOR_A.SchDoc, left]
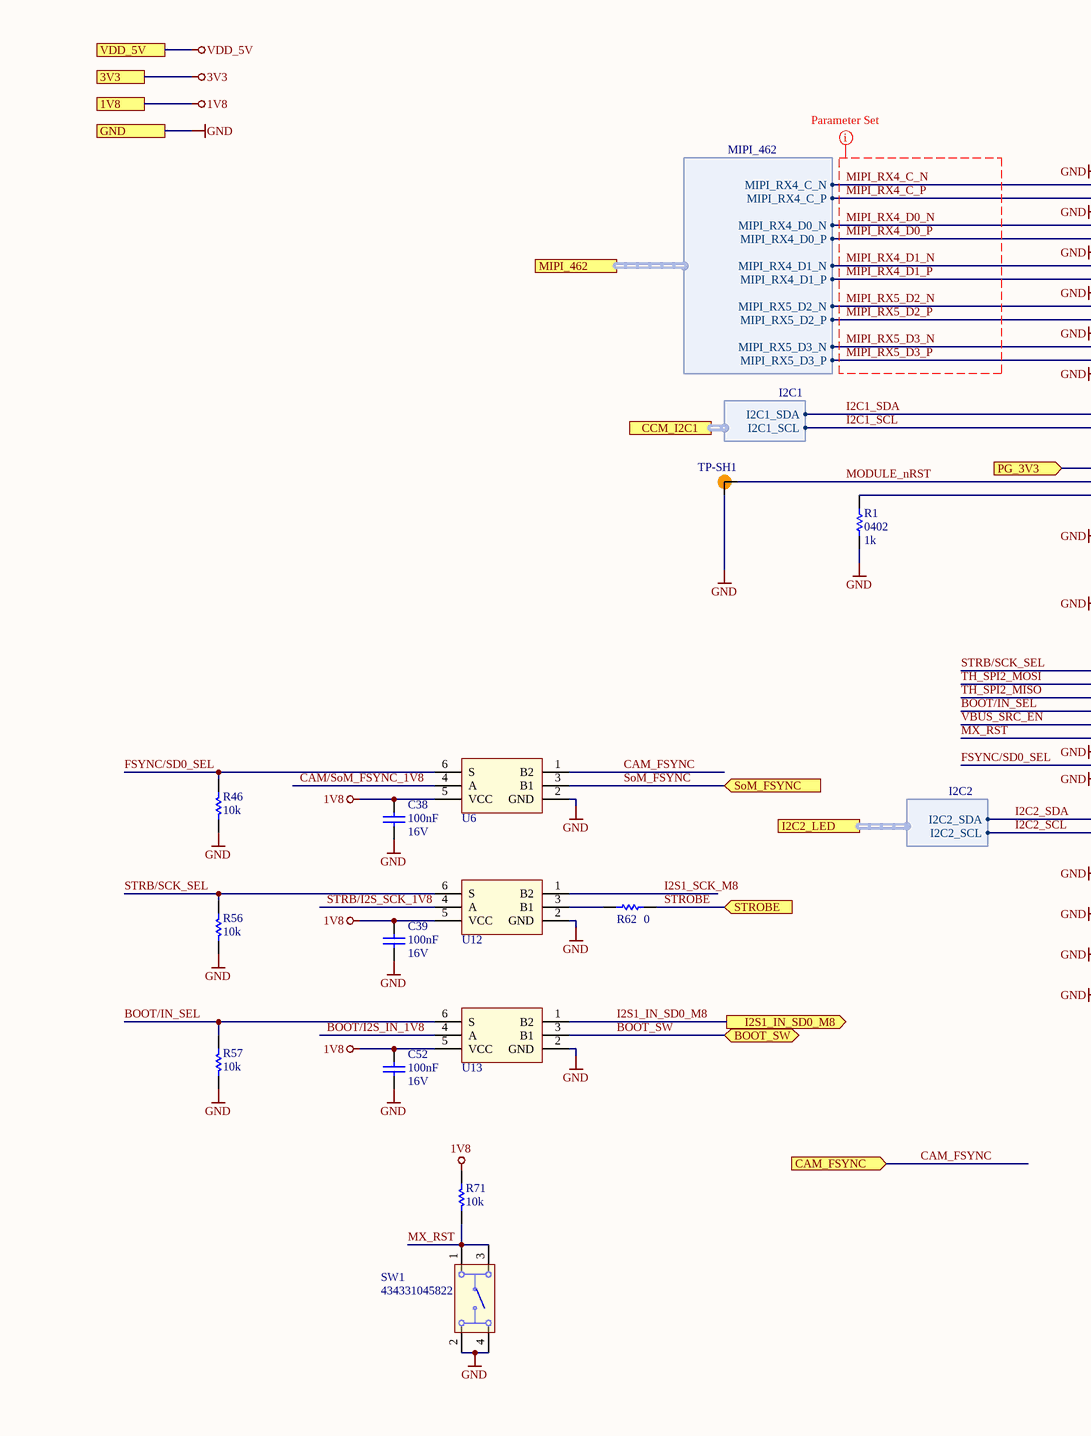
[diagram p4: CONNECTOR_A.SchDoc, middle]
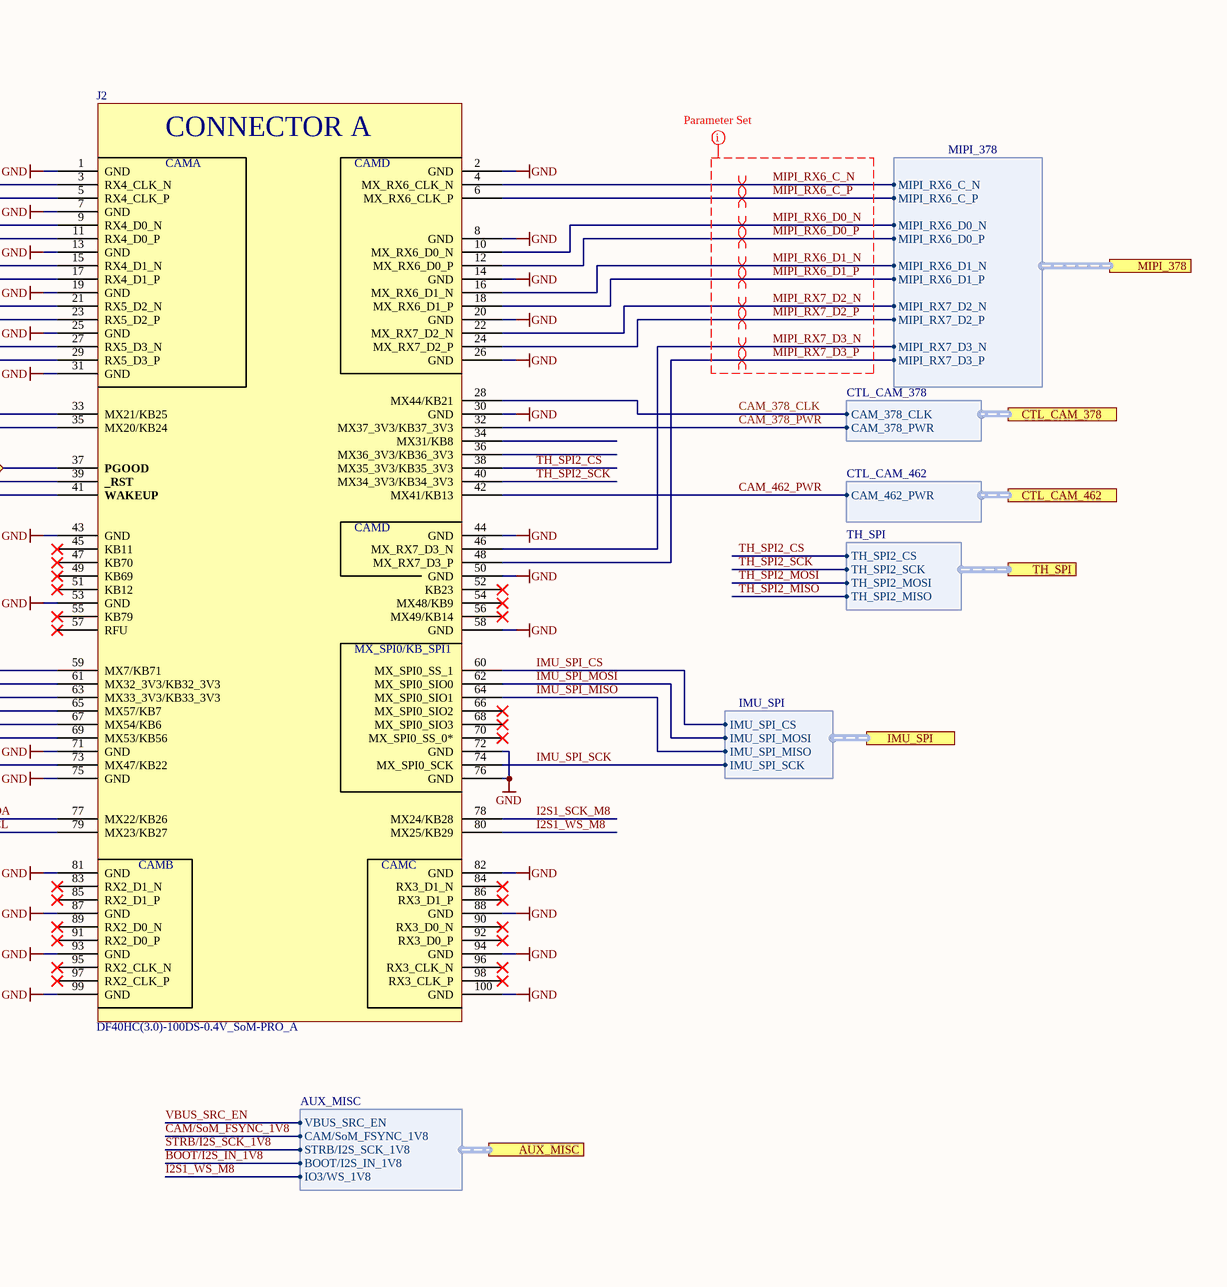
[diagram p5: CONNECTOR_A.SchDoc, right]

### Parts
C38  value 100nF  Voltage Rating: 16V  [CAPC0402(1005)60_L]  (hidden comment: CL05B104KO5NFNC)
C39  value 100nF  Voltage Rating: 16V  [CAPC0402(1005)60_L]  (hidden comment: CL05B104KO5NFNC)
C52  value 100nF  Voltage Rating: 16V  [CAPC0402(1005)60_L]  (hidden comment: CL05B104KO5NFNC)
J2  DF40HC(3.0)-100DS-0.4V_SoM-PRO_A  [CON_A_BW2099_SoM_DF40HC-3.0-100DS-0.4V_minpad]
R1  value 1k  Case/Package: 0402  [RESC1005X40X25ML05T05]  (hidden comment: ERJ-2RKF1001X)
R46  value 10k  [RESC0402(1005)_L]  (hidden comment: RC0402FR-1310KL)
R56  value 10k  [RESC0402(1005)_L]  (hidden comment: RC0402FR-1310KL)
R57  value 10k  [RESC0402(1005)_L]  (hidden comment: RC0402FR-1310KL)
R62  0  [RESC0402(1005)_L]
R71  value 10k  [RESC0402(1005)_L]  (hidden comment: RC0402FR-1310KL)
SW1  434331045822  [434331045822]
TP-SH1  TEST_SHORT  [TP_short]  (value not drawn)  (no BOM)
U6  SN74LVC1G3157DCKR  [DCK6_65]  (value not drawn)
U12  SN74LVC1G3157DCKR  [DCK6_65]  (value not drawn)
U13  SN74LVC1G3157DCKR  [DCK6_65]  (value not drawn)

### Ports
1V8, 3V3, AUX_MISC (harness AUX_MISC), BOOT_SW (bidir), CAM_FSYNC (in), CCM_I2C1 (harness I2C1), CTL_CAM_378 (harness CTL_CAM_378), CTL_CAM_462 (harness CTL_CAM_462), GND, I2C2_LED (harness I2C2), I2S1_IN_SD0_M8 (out), IMU_SPI (harness IMU_SPI), MIPI_378 (harness MIPI_378), MIPI_462 (harness MIPI_462), PG_3V3 (in), SoM_FSYNC (in), STROBE (in), TH_SPI (harness TH_SPI), VDD_5V

### Harnesses
I2C1: I2C1_SDA, I2C1_SCL
IMU_SPI: IMU_SPI_CS, IMU_SPI_MOSI, IMU_SPI_MISO, IMU_SPI_SCK
CTL_CAM_462: CAM_462_PWR
MIPI_462: MIPI_RX4_C_N, MIPI_RX4_C_P, MIPI_RX4_D0_N, MIPI_RX4_D0_P, MIPI_RX4_D1_N, MIPI_RX4_D1_P, MIPI_RX5_D2_N, MIPI_RX5_D2_P, MIPI_RX5_D3_N, MIPI_RX5_D3_P
MIPI_378: MIPI_RX6_C_N, MIPI_RX6_C_P, MIPI_RX6_D0_N, MIPI_RX6_D0_P, MIPI_RX6_D1_N, MIPI_RX6_D1_P, MIPI_RX7_D2_N, MIPI_RX7_D2_P, MIPI_RX7_D3_N, MIPI_RX7_D3_P
AUX_MISC: VBUS_SRC_EN, CAM/SoM_FSYNC_1V8, STRB/I2S_SCK_1V8, BOOT/I2S_IN_1V8, IO3/WS_1V8
CTL_CAM_378: CAM_378_CLK, CAM_378_PWR
TH_SPI: TH_SPI2_CS, TH_SPI2_SCK, TH_SPI2_MOSI, TH_SPI2_MISO
I2C2: I2C2_SDA, I2C2_SCL

### Nets
1V8: C38.2 C39.2 C52.2 R71.2 U6.5(VCC) U12.5(VCC) U13.5(VCC) ; port 1V8
GND: C38.1 C39.1 C52.1 J2.1(GND) J2.2(GND) J2.7(GND) J2.8(GND) J2.13(GND) J2.14(GND) J2.19(GND) J2.20(GND) J2.25(GND) J2.26(GND) J2.30(GND) J2.31(GND) J2.43(GND) J2.44(GND) J2.50(GND) J2.53(GND) J2.58(GND) J2.71(GND) J2.72(GND) J2.75(GND) J2.76(GND) J2.81(GND) J2.82(GND) J2.87(GND) J2.88(GND) J2.93(GND) J2.94(GND) J2.99(GND) J2.100(GND) R1.1 R46.1 R56.1 R57.1 SW1.2 SW1.4 TP-SH1.1 U6.2(GND) U12.2(GND) U13.2(GND) ; port GND
BOOT/I2S_IN_1V8: U13.4(A) ; port AUX_MISC.BOOT/I2S_IN_1V8
BOOT/IN_SEL: J2.65(MX57/KB7) R57.2 U13.6(S)
BOOT_SW: U13.3(B1) ; port BOOT_SW
CAM/SoM_FSYNC_1V8: U6.4(A) ; port AUX_MISC.CAM/SoM_FSYNC_1V8
CAM_378_CLK: J2.28(MX44/KB21) ; port CTL_CAM_378.CAM_378_CLK
CAM_378_PWR: J2.32(MX37_3V3/KB37_3V3) ; port CTL_CAM_378.CAM_378_PWR
CAM_462_PWR: J2.42(MX41/KB13) ; port CTL_CAM_462.CAM_462_PWR
CAM_FSYNC: U6.1(B2) ; port CAM_FSYNC
FSYNC/SD0_SEL: J2.73(MX47/KB22) R46.2 U6.6(S)
I2C1_SCL: J2.35(MX20/KB24) ; port CCM_I2C1.I2C1_SCL
I2C1_SDA: J2.33(MX21/KB25) ; port CCM_I2C1.I2C1_SDA
I2C2_SCL: J2.79(MX23/KB27) ; port I2C2_LED.I2C2_SCL
I2C2_SDA: J2.77(MX22/KB26) ; port I2C2_LED.I2C2_SDA
I2S1_IN_SD0_M8: U13.1(B2) ; port I2S1_IN_SD0_M8
I2S1_SCK_M8: J2.78(MX24/KB28) U12.1(B2)
I2S1_WS_M8: J2.80(MX25/KB29) ; port AUX_MISC.IO3/WS_1V8
IMU_SPI_CS: J2.60(MX_SPI0_SS_1) ; port IMU_SPI.IMU_SPI_CS
IMU_SPI_MISO: J2.64(MX_SPI0_SIO1) ; port IMU_SPI.IMU_SPI_MISO
IMU_SPI_MOSI: J2.62(MX_SPI0_SIO0) ; port IMU_SPI.IMU_SPI_MOSI
IMU_SPI_SCK: J2.74(MX_SPI0_SCK) ; port IMU_SPI.IMU_SPI_SCK
MIPI_RX4_C_N: J2.3(RX4_CLK_N) ; port MIPI_462.MIPI_RX4_C_N
MIPI_RX4_C_P: J2.5(RX4_CLK_P) ; port MIPI_462.MIPI_RX4_C_P
MIPI_RX4_D0_N: J2.9(RX4_D0_N) ; port MIPI_462.MIPI_RX4_D0_N
MIPI_RX4_D0_P: J2.11(RX4_D0_P) ; port MIPI_462.MIPI_RX4_D0_P
MIPI_RX4_D1_N: J2.15(RX4_D1_N) ; port MIPI_462.MIPI_RX4_D1_N
MIPI_RX4_D1_P: J2.17(RX4_D1_P) ; port MIPI_462.MIPI_RX4_D1_P
MIPI_RX5_D2_N: J2.21(RX5_D2_N) ; port MIPI_462.MIPI_RX5_D2_N
MIPI_RX5_D2_P: J2.23(RX5_D2_P) ; port MIPI_462.MIPI_RX5_D2_P
MIPI_RX5_D3_N: J2.27(RX5_D3_N) ; port MIPI_462.MIPI_RX5_D3_N
MIPI_RX5_D3_P: J2.29(RX5_D3_P) ; port MIPI_462.MIPI_RX5_D3_P
MIPI_RX6_C_N: J2.4(MX_RX6_CLK_N) ; port MIPI_378.MIPI_RX6_C_N
MIPI_RX6_C_P: J2.6(MX_RX6_CLK_P) ; port MIPI_378.MIPI_RX6_C_P
MIPI_RX6_D0_N: J2.10(MX_RX6_D0_N) ; port MIPI_378.MIPI_RX6_D0_N
MIPI_RX6_D0_P: J2.12(MX_RX6_D0_P) ; port MIPI_378.MIPI_RX6_D0_P
MIPI_RX6_D1_N: J2.16(MX_RX6_D1_N) ; port MIPI_378.MIPI_RX6_D1_N
MIPI_RX6_D1_P: J2.18(MX_RX6_D1_P) ; port MIPI_378.MIPI_RX6_D1_P
MIPI_RX7_D2_N: J2.22(MX_RX7_D2_N) ; port MIPI_378.MIPI_RX7_D2_N
MIPI_RX7_D2_P: J2.24(MX_RX7_D2_P) ; port MIPI_378.MIPI_RX7_D2_P
MIPI_RX7_D3_N: J2.46(MX_RX7_D3_N) ; port MIPI_378.MIPI_RX7_D3_N
MIPI_RX7_D3_P: J2.48(MX_RX7_D3_P) ; port MIPI_378.MIPI_RX7_D3_P
MODULE_nRST: J2.39(_RST) TP-SH1.2
MX_RST: J2.69(MX53/KB56) R71.1 SW1.1 SW1.3
PG_3V3: J2.37(PGOOD) ; port PG_3V3
SoM_FSYNC: U6.3(B1) ; port SoM_FSYNC
STRB/I2S_SCK_1V8: U12.4(A) ; port AUX_MISC.STRB/I2S_SCK_1V8
STRB/SCK_SEL: J2.59(MX7/KB71) R56.2 U12.6(S)
STROBE: R62.1 ; port STROBE
TH_SPI2_CS: J2.38(MX35_3V3/KB35_3V3) ; port TH_SPI.TH_SPI2_CS
TH_SPI2_MISO: J2.63(MX33_3V3/KB33_3V3) ; port TH_SPI.TH_SPI2_MISO
TH_SPI2_MOSI: J2.61(MX32_3V3/KB32_3V3) ; port TH_SPI.TH_SPI2_MOSI
TH_SPI2_SCK: J2.40(MX34_3V3/KB34_3V3) ; port TH_SPI.TH_SPI2_SCK
VBUS_SRC_EN: J2.67(MX54/KB6) ; port AUX_MISC.VBUS_SRC_EN
NetJ2_41: J2.41(WAKEUP) R1.2
NetR62_2: R62.2 U12.3(B1)

Not connected (* = marked no-connect by the designer): J2 34(MX31/KB8) 36(MX36_3V3/KB36_3V3) 45(KB11)* 47(KB70)* 49(KB69)* 51(KB12)* 52(KB23)* 54(MX48/KB9)* 55(KB79)* 56(MX49/KB14)* 57(RFU)* 66(MX_SPI0_SIO2)* 68(MX_SPI0_SIO3)* 70(MX_SPI0_SS_0*)* 83(RX2_D1_N)* 84(RX3_D1_N)* 85(RX2_D1_P)* 86(RX3_D1_P)* 89(RX2_D0_N)* 90(RX3_D0_N)* 91(RX2_D0_P)* 92(RX3_D0_P)* 95(RX2_CLK_N)* 96(RX3_CLK_N)* 97(RX2_CLK_P)* 98(RX3_CLK_P)*

### Layout directives
differential pair; differential pair class 100ohm: MIPI_RX6_C_N, MIPI_RX6_C_P, MIPI_RX6_D0_N, MIPI_RX6_D0_P, MIPI_RX6_D1_N, MIPI_RX6_D1_P, MIPI_RX7_D2_N, MIPI_RX7_D2_P, MIPI_RX7_D3_N, MIPI_RX7_D3_P
net class MIPI_IMX378: MIPI_RX6_C_N, MIPI_RX6_C_P, MIPI_RX6_D0_N, MIPI_RX6_D0_P, MIPI_RX6_D1_N, MIPI_RX6_D1_P, MIPI_RX7_D2_N, MIPI_RX7_D2_P, MIPI_RX7_D3_N, MIPI_RX7_D3_P
net class MIPI_IMX462: MIPI_RX4_C_N, MIPI_RX4_C_P, MIPI_RX4_D0_N, MIPI_RX4_D0_P, MIPI_RX4_D1_N, MIPI_RX4_D1_P, MIPI_RX5_D2_N, MIPI_RX5_D2_P, MIPI_RX5_D3_N, MIPI_RX5_D3_P

### Notes on the sheet
- Moved RGB control pins here.
- Title
- Size:
- Date:
- Tabloid
- Number:
- Time:
- Revision:
- Sheet
- of
- Drawn by:
- (in symbol CMP-002-00154-9) CONNECTOR A; CAMA; CAMD; MX_SPI0/KB_SPI1; CAMB; CAMC

### Library data of the parts
C38 C39 C52 = CMP-108-000002-6: CAP CER 0.1UF 16V X7R 0402 10%; Manufacturer 1: Samsung; Case/Package: 0402; ComponentLink1URL: https://datasheet.ciiva.com/25767/cl05b104ko5nfnc-25767124.pdf?src-supplier=Digi-Key; Length: 1mm; Design Item ID: CL05B104KO5NFNC; Tolerance: 10%; Min Operating Temperature: -55°C; Width: 0.02inch; Dielectric: X7R; ComponentLink1Description: https://datasheet.ciiva.com/25767/cl05b104ko5nfnc-25767124.pdf?src-supplier=Digi-Key; Height: 0.5mm; Depth: 0.5mm; Manufacturer Part Number 1: CL05B104KO5NFNC; Max Operating Temperature: 125°C; Mounting Technology: SMT
J2 = CMP-002-00154-9: OAK-SoM-Pro_S2/S3 base board conn. A; Manufacturer Part Number 1: DF40HC(3.0)-100DS-0.4V(58); Manufacturer 1: Hirose; System: Connector; Pitch: 0.016inch; Connector Type: Receptacle; Gender: Female; Number of Positions: 100; Stock 2: 2078; RoHS: Yes; ComponentLink3URL: https://datasheet.ciiva.com/13559/ed-df40-20140305-13559540.pdf?src-supplier=Mouser; Package Quantity: 1000; ComponentLink1Description: https://datasheet.ciiva.com/46636/ed-df40-20140305-46636517.pdf?src-supplier=Digi-Key; ComponentLink3Description: https://datasheet.ciiva.com/13559/ed-df40-20140305-13559540.pdf?src-supplier=Mouser; Mounting Technology: SMT; Number of Rows: 2; Mount: Surface Mount; Packaging: Tape and Reel; ComponentLink1URL: https://datasheet.ciiva.com/46636/ed-df40-20140305-46636517.pdf?src-supplier=Digi-Key; Stock 1: 2172; Contact Plating: Gold; Pricing 1: 1=2.54000, 10=2.26000, 25=2.07000, 50=2.07000, 100=1.98000, 250=1.79000, 500=1.65000, 1000=1.41000, 3000=1.32000, 6000=1.23000, 10000=1.23000 (USD); ComponentLink4URL: https://datasheet.ciiva.com/18562/ed-df40-20140305-18562462.pdf?src-supplier=Digi-Key; ComponentLink2Description: https://datasheet.ciiva.com/18562/ed-df40-20140305-18562189.pdf?src-supplier=Digi-Key; Design Item ID: DF40HC(3.0)-100DS-0.4V_SoM-PRO_A; ComponentLink4Description: https://datasheet.ciiva.com/18562/ed-df40-20140305-18562462.pdf?src-supplier=Digi-Key; Source: LuxonisMaster.SchLib; Pricing 2: 1=2.50000, 10=2.40000, 25=2.10000, 50=2.10000, 100=2.00000, 250=1.76000, 500=1.71000, 1000=1.45000, 2000=1.36000, 5000=1.31000, 10000=1.31000 (USD); Pins: 100; Lead Free: Lead Free; ComponentLink2URL: https://datasheet.ciiva.com/18562/ed-df40-20140305-18562189.pdf?src-supplier=Digi-Key
R1 = CMP-009-00009-15: RES SMD 1K OHM 1% 0.1W 0402; Manufacturer 1: Panasonic; Voltage Rating: 50V; Power Rating: 100mW; Tolerance: 1%; Max Operating Temperature: 155°C; Manufacturer Part Number 1: ERJ-2RKF1001X; Min Operating Temperature: -55°C
R46 R56 R57 R71 = CMP-115-000004-8: as R11 on sheet CONNECTOR_B; Tolerance: 1%; Max Operating Temperature: 155°C; Case/Package: 0402; Manufacturer Part Number 1: RC0402FR-1310KL; Min Operating Temperature: -55°C; Design Item ID: RC0402FR-1310KL
R62 = CMP-013-000022-11: RES SMD 0 OHM 5% 1/16W 0402; Manufacturer 1: Vishay; Manufacturer Part Number 1: CRCW04020000Z0ED; Power Rating: 63mW; Voltage Rating: 50V; Case/Package: 0402; Min Operating Temperature: -55°C; Max Operating Temperature: 155°C; Tolerance: 5%; Value: 0; Design Item ID: CRCW04020000Z0ED
SW1 = CMP-011-00016-3: as B1 on sheet CONNECTOR_B; Supplier Part Number 1: 732-7055-2-ND; Manufacturer part number 1: 434331045822; Pins: 4; Supplier 1: Digi-Key; Current Rating: 50mA; Mounting Technology: SMD; Case/Package: 434331045822
TP-SH1 = CMP-249-000001-3: Manufacturer Part Number 1: /; Source: DM9098.SchLib; Design Item ID: TEST_SHORT
U6 U12 U13 = CMP-010-000023-3: IC SWITCH SPDT SC70-6 1 Circuit IC Switch 2:1 15Ohm SC-70-6; Manufacturer 1: Texas Instruments; Max Operating Temperature: 125°C; Manufacturer Part Number 1: SN74LVC1G3157DCKR; Min Operating Temperature: -40°C; Case/Package: SC

## Sheet ETH_PCIE_CTRL.SchDoc: =project_title
size Tabloid; CompanyName: Luxonis Holding; DrawnBy: Martin Debevc; Organization: Luxonis Holding; Address1: 1925 Harmony Park Drive; Address2: Westminster, CO; Address3: 80234; Address4: United States; DocumentNumber: D2088000; Revision: R3M2E2; SheetNumber: 8; SheetTotal: 13
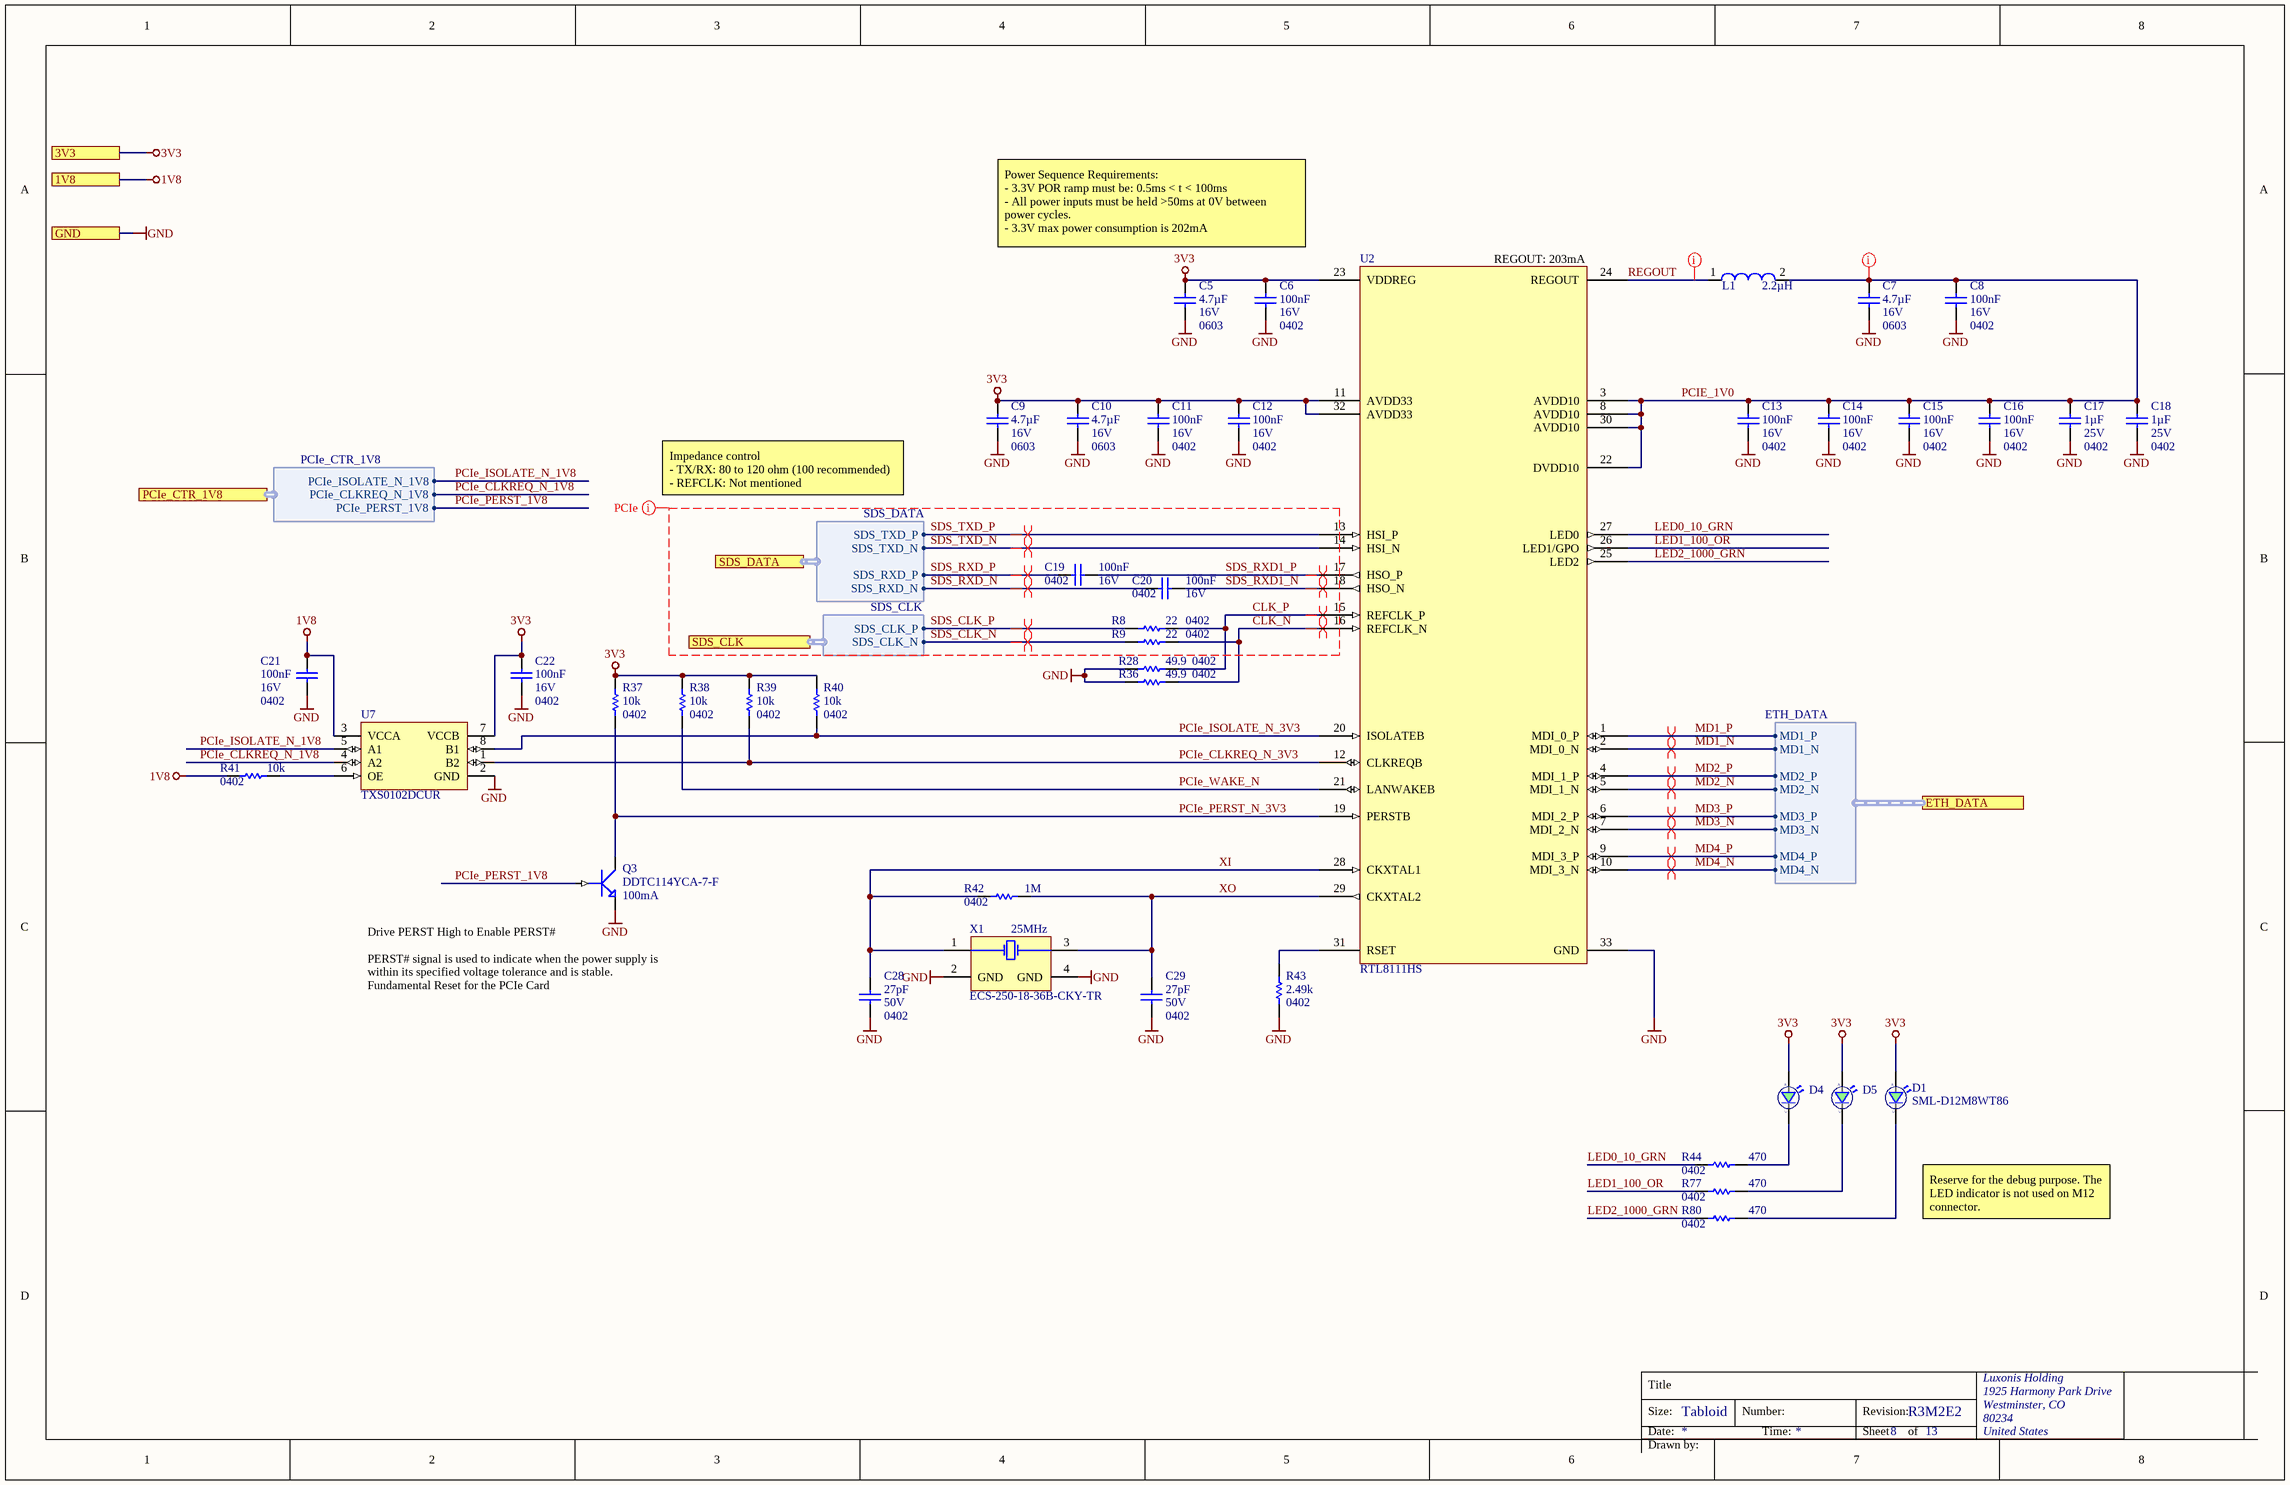
[diagram p6: ETH_PCIE_CTRL.SchDoc]

### Parts
C5  value 4.7µF  Voltage Rating: 16V  Case/Package: 0603  [CAPC0603(1608)100_L]  (hidden comment: GRM188R61C475KAAJD)
C6  value 100nF  Voltage Rating: 16V  Case/Package: 0402  [CAPC0402(1005)60_L]  (hidden comment: CL05B104KO5NFNC)
C7  value 4.7µF  Voltage Rating: 16V  Case/Package: 0603  [CAPC0603(1608)100_L]  (hidden comment: GRM188R61C475KAAJD)
C8  value 100nF  Voltage Rating: 16V  Case/Package: 0402  [CAPC0402(1005)60_L]  (hidden comment: CL05B104KO5NFNC)
C9  value 4.7µF  Voltage Rating: 16V  Case/Package: 0603  [CAPC0603(1608)100_L]  (hidden comment: GRM188R61C475KAAJD)
C10  value 4.7µF  Voltage Rating: 16V  Case/Package: 0603  [CAPC0603(1608)100_L]  (hidden comment: GRM188R61C475KAAJD)
C11  value 100nF  Voltage Rating: 16V  Case/Package: 0402  [CAPC0402(1005)60_L]  (hidden comment: CL05B104KO5NFNC)
C12  value 100nF  Voltage Rating: 16V  Case/Package: 0402  [CAPC0402(1005)60_L]  (hidden comment: CL05B104KO5NFNC)
C13  value 100nF  Voltage Rating: 16V  Case/Package: 0402  [CAPC0402(1005)60_L]  (hidden comment: CL05B104KO5NFNC)
C14  value 100nF  Voltage Rating: 16V  Case/Package: 0402  [CAPC0402(1005)60_L]  (hidden comment: CL05B104KO5NFNC)
C15  value 100nF  Voltage Rating: 16V  Case/Package: 0402  [CAPC0402(1005)60_L]  (hidden comment: CL05B104KO5NFNC)
C16  value 100nF  Voltage Rating: 16V  Case/Package: 0402  [CAPC0402(1005)60_L]  (hidden comment: CL05B104KO5NFNC)
C17  value 1µF  Voltage Rating: 25V  Case/Package: 0402  [CAPC0402(1005)70_L]  (hidden comment: GRM155R61E105KA12D)
C18  value 1µF  Voltage Rating: 25V  Case/Package: 0402  [CAPC0402(1005)70_L]  (hidden comment: GRM155R61E105KA12D)
C19  value 100nF  Voltage Rating: 16V  Case/Package: 0402  [CAPC0402(1005)60_L]  (hidden comment: CL05B104KO5NFNC)
C20  value 100nF  Voltage Rating: 16V  Case/Package: 0402  [CAPC0402(1005)60_L]  (hidden comment: CL05B104KO5NFNC)
C21  value 100nF  Voltage Rating: 16V  Case/Package: 0402  [CAPC0402(1005)60_L]  (hidden comment: CL05B104KO5NFNC)
C22  value 100nF  Voltage Rating: 16V  Case/Package: 0402  [CAPC0402(1005)60_L]  (hidden comment: CL05B104KO5NFNC)
C28  value 27pF  Voltage Rating: 50V  Case/Package: 0402  [CAPC0402(1005)60_L]  (hidden comment: C0402C270J5GACTU)
C29  value 27pF  Voltage Rating: 50V  Case/Package: 0402  [CAPC0402(1005)60_L]  (hidden comment: C0402C270J5GACTU)
D1  SML-D12M8WT86  [SML_D1xx8W]
D4  SML-D12M8WT86  [SML_D1xx8W]  (value not drawn)
D5  SML-D12M8WT86  [SML_D1xx8W]  (value not drawn)
L1  value 2.2µH  [LQH32NH2R2J23L]  (hidden comment: BRL3225T2R2M)
Q3  DDTC114YCA-7-F  Continuous Drain Current: 100mA  [DDTC114YCA-7-F-Footprint-1]
R8  value 22  Case/Package: 0402  [RESC0402(1005)_L]  (hidden comment: RC0402FR-0722RL)
R9  value 22  Case/Package: 0402  [RESC0402(1005)_L]  (hidden comment: RC0402FR-0722RL)
R28  value 49.9  Case/Package: 0402  [RESC0402(1005)_L]  (hidden comment: RC0402FR-0749R9L)
R36  value 49.9  Case/Package: 0402  [RESC0402(1005)_L]  (hidden comment: RC0402FR-0749R9L)
R37  value 10k  Case/Package: 0402  [RESC0402(1005)_L]  (hidden comment: RC0402FR-1310KL)
R38  value 10k  Case/Package: 0402  [RESC0402(1005)_L]  (hidden comment: RC0402FR-1310KL)
R39  value 10k  Case/Package: 0402  [RESC0402(1005)_L]  (hidden comment: RC0402FR-1310KL)
R40  value 10k  Case/Package: 0402  [RESC0402(1005)_L]  (hidden comment: RC0402FR-1310KL)
R41  value 10k  Case/Package: 0402  [RESC0402(1005)_L]  (hidden comment: RC0402FR-1310KL)
R42  value 1M  Case/Package: 0402  [RESC0402(1005)_L]  (hidden comment: RC0402FR-071ML)
R43  value 2.49k  Case/Package: 0402  [RESC0402(1005)_L]  (hidden comment: RC0402FR-072K49L)
R44  value 470  Case/Package: 0402  [RESC0402(1005)_L]  (hidden comment: CRCW0402470RFKED)
R77  value 470  Case/Package: 0402  [RESC0402(1005)_L]  (hidden comment: CRCW0402470RFKED)
R80  value 470  Case/Package: 0402  [RESC0402(1005)_L]  (hidden comment: CRCW0402470RFKED)
U2  RTL8111HS  [RTL8111Hx-CG]
U7  TXS0102DCUR  [TXS0102DCUR]
X1  ECS-250-18-36B-CKY-TR  Frequency: 25MHz  [ECS-250-18-36B-CKY-TR]

### Ports
1V8, 3V3, ETH_DATA (harness ETH_DATA), GND, PCIe_CTR_1V8 (harness PCIe_CTR_1V8), SDS_CLK (harness SDS_CLK), SDS_DATA (harness SDS_DATA)

### Harnesses
ETH_DATA: MD1_P, MD1_N, MD2_P, MD2_N, MD3_P, MD3_N, MD4_P, MD4_N
SDS_DATA: SDS_TXD_P, SDS_TXD_N, SDS_RXD_P, SDS_RXD_N
SDS_CLK: SDS_CLK_P, SDS_CLK_N
PCIe_CTR_1V8: PCIe_CLKREQ_N_1V8, PCIe_ISOLATE_N_1V8, PCIe_PERST_1V8

### Nets
1V8: C21.2 R41.1 U7.3(VCCA) ; port 1V8
3V3: C5.2 C6.2 C9.2 C10.2 C11.2 C12.2 C22.2 D1.2(A) D4.2(A) D5.2(A) R37.2 R38.2 R39.2 R40.2 U2.11(AVDD33) U2.23(VDDREG) U2.32(AVDD33) U7.7(VCCB) ; port 3V3
GND: C5.1 C6.1 C7.1 C8.1 C9.1 C10.1 C11.1 C12.1 C13.1 C14.1 C15.1 C16.1 C17.1 C18.1 C21.1 C22.1 C28.1 C29.1 Q3.2(E) R28.1 R36.1 R43.1 U2.33(GND) U7.2(GND) X1.2(GND) X1.4(GND) ; port GND
CLK_N: R9.2 R36.2 U2.16(REFCLK_N)
CLK_P: R8.2 R28.2 U2.15(REFCLK_P)
LED0_10_GRN: R44.1 U2.27(LED0)
LED1_100_OR: R77.1 U2.26(LED1/GPO)
LED2_1000_GRN: R80.1 U2.25(LED2)
MD1_N: U2.2(MDI_0_N) ; port ETH_DATA.MD1_N
MD1_P: U2.1(MDI_0_P) ; port ETH_DATA.MD1_P
MD2_N: U2.5(MDI_1_N) ; port ETH_DATA.MD2_N
MD2_P: U2.4(MDI_1_P) ; port ETH_DATA.MD2_P
MD3_N: U2.7(MDI_2_N) ; port ETH_DATA.MD3_N
MD3_P: U2.6(MDI_2_P) ; port ETH_DATA.MD3_P
MD4_N: U2.10(MDI_3_N) ; port ETH_DATA.MD4_N
MD4_P: U2.9(MDI_3_P) ; port ETH_DATA.MD4_P
PCIE_1V0: C7.2 C8.2 C13.2 C14.2 C15.2 C16.2 C17.2 C18.2 L1.2 U2.3(AVDD10) U2.8(AVDD10) U2.22(DVDD10) U2.30(AVDD10)
PCIe_CLKREQ_N_1V8: U7.4(A2) ; port PCIe_CTR_1V8.PCIe_CLKREQ_N_1V8
PCIe_CLKREQ_N_3V3: R39.1 U2.12(CLKREQB) U7.1(B2)
PCIe_ISOLATE_N_1V8: U7.5(A1) ; port PCIe_CTR_1V8.PCIe_ISOLATE_N_1V8
PCIe_ISOLATE_N_3V3: R40.1 U2.20(ISOLATEB) U7.8(B1)
PCIe_PERST_1V8: Q3.1(B) ; port PCIe_CTR_1V8.PCIe_PERST_1V8
PCIe_PERST_N_3V3: Q3.3(C) R37.1 U2.19(PERSTB)
PCIe_WAKE_N: R38.1 U2.21(LANWAKEB)
REGOUT: L1.1 U2.24(REGOUT)
SDS_CLK_N: R9.1 ; port SDS_CLK.SDS_CLK_N
SDS_CLK_P: R8.1 ; port SDS_CLK.SDS_CLK_P
SDS_RXD1_N: C20.1 U2.18(HSO_N)
SDS_RXD1_P: C19.1 U2.17(HSO_P)
SDS_RXD_N: C20.2 ; port SDS_DATA.SDS_RXD_N
SDS_RXD_P: C19.2 ; port SDS_DATA.SDS_RXD_P
SDS_TXD_N: U2.14(HSI_N) ; port SDS_DATA.SDS_TXD_N
SDS_TXD_P: U2.13(HSI_P) ; port SDS_DATA.SDS_TXD_P
XI: C28.2 R42.1 U2.28(CKXTAL1) X1.1(X1)
XO: C29.2 R42.2 U2.29(CKXTAL2) X1.3(X2)
NetD1_1: D1.1(C) R80.2
NetD4_1: D4.1(C) R44.2
NetD5_1: D5.1(C) R77.2
NetR41_2: R41.2 U7.6(OE)
NetR43_2: R43.2 U2.31(RSET)

### Layout directives
differential pair; net class ETH; differential pair class 100ohm: MD1_N, MD1_P, MD2_N, MD2_P, MD3_N, MD3_P, MD4_N, MD4_P
net class PCIe: CLK_N, CLK_P, SDS_CLK_N, SDS_CLK_P, SDS_RXD1_N, SDS_RXD1_P, SDS_RXD_N, SDS_RXD_P, SDS_TXD_N, SDS_TXD_P
differential pair; net class PCIE; differential pair class 100ohm: CLK_N, CLK_P, SDS_CLK_N, SDS_CLK_P, SDS_RXD1_N, SDS_RXD1_P, SDS_RXD_N, SDS_RXD_P, SDS_TXD_N, SDS_TXD_P
net class PWR; Current Rating: 1200mA: PCIE_1V0, REGOUT

### Notes on the sheet
- Power Sequence Requirements:
  - 3.3V POR ramp must be: 0.5ms < t < 100ms
  - All power inputs must be held >50ms at 0V between power cycles.
  - 3.3V max power consumption is 202mA
- (near U2) REGOUT: 203mA
- Impedance control
  - TX/RX: 80 to 120 ohm (100 recommended)
  - REFCLK: Not mentioned
  - Confirmed that 100ohm on TX/RX/REFCLK of NG2099
- (near Q3) Drive PERST High to Enable PERST#
- PERST# signal is used to indicate when the power supply is within its specified voltage tolerance and is stable.
  Fundamental Reset for the PCIe Card
- Reserve for the debug purpose. The LED indicator is not used on M12 connector.
- Title
- Size:
- Date:
- Tabloid
- Number:
- Time:
- Revision:
- Sheet
- of
- Drawn by:

### Library data of the parts
C5 C7 C9 C10 = CMP-004-000020-4: CAP CER 4.7UF 16V X5R 0603 10%; Manufacturer 1: Murata; Max Operating Temperature: 85°C; Dielectric: X5R; Design Item ID: GRM188R61C475KAAJD; Depth: 0.8mm; Width: 0.8mm; Manufacturer 2: Murata; Manufacturer Part Number 3: GRM188R61C475KAAJD; Manufacturer Part Number 2: GRM188R61C475KAAJD; ComponentLink1Description: https://datasheet.ciiva.com/14813/595grm188r61c475kaaj23-14813668.pdf?src-supplier=Arrow; ComponentLink1URL: https://datasheet.ciiva.com/14813/595grm188r61c475kaaj23-14813668.pdf?src-supplier=Arrow; Manufacturer Part Number 1: GRM188R61C475KAAJD; Manufacturer 3: Murata; Mounting Technology: SMT; Tolerance: 10%; Length: 1.6mm; Min Operating Temperature: -55°C; Height: 0.8mm
C6 C8 C11-C16 C19-C22 = CMP-108-000002-6: as C38 on sheet CONNECTOR_A; ComponentLink1URL: https://datasheet.ciiva.com/25767/cl05b104ko5nfnc-25767124.pdf?src-supplier=Digi-Key; Length: 1mm; Design Item ID: CL05B104KO5NFNC; Tolerance: 10%; Min Operating Temperature: -55°C; Width: 0.02inch; Dielectric: X7R; ComponentLink1Description: https://datasheet.ciiva.com/25767/cl05b104ko5nfnc-25767124.pdf?src-supplier=Digi-Key; Height: 0.5mm; Depth: 0.5mm; Manufacturer Part Number 1: CL05B104KO5NFNC; Max Operating Temperature: 125°C; Mounting Technology: SMT
C17 C18 = CMP-108-000014-5: CAP CER 1UF 25V X5R 0402 10%; Manufacturer 1: Murata; ComponentLink2Description: https://datasheet.ciiva.com/7719/1666664-7719006.pdf?src-supplier=Element14; ComponentLink2URL: https://datasheet.ciiva.com/7719/1666664-7719006.pdf?src-supplier=Element14; Max Operating Temperature: 85°C; Depth: 0.5mm; Mounting Technology: SMT; ComponentLink1URL: https://datasheet.ciiva.com/22732/1666664-22732122.pdf?src-supplier=Element14; Length: 1mm; ComponentLink1Description: https://datasheet.ciiva.com/22732/1666664-22732122.pdf?src-supplier=Element14; Manufacturer Part Number 1: GRM155R61E105KA12D; Tolerance: 10%; Design Item ID: GRM155R61E105KA12D; Dielectric: X5R; Min Operating Temperature: -55°C; Height: 0.5mm; Width: 0.5mm
C28 C29 = CMP-108-000006-6: CAP CER 27PF 50V C0G 0402 5%; Manufacturer 1: KEMET; Min Operating Temperature: -55°C; Mounting Technology: SMT; Design Item ID: C0402C270J5GACTU; Tolerance: 5%; Max Operating Temperature: 125°C; ComponentLink4Description: https://datasheet.ciiva.com/7392/1372242-7392237.pdf?src-supplier=Newark; Width: 0.5mm; Length: 1mm; ComponentLink1URL: https://datasheet.ciiva.com/144/docfinderpartnumber-c0402c270j5gactu-144118.pdf?src-supplier=Digi-Key; ComponentLink2URL: https://datasheet.ciiva.com/7747/kem-c1003-c0g-smd-7747509.pdf?src-supplier=Element14; ComponentLink4URL: https://datasheet.ciiva.com/7392/1372242-7392237.pdf?src-supplier=Newark; ComponentLink5Description: https://datasheet.ciiva.com/14586/70095383-14586671.pdf?src-supplier=Allied+Electronics; Height: 0.5mm; ComponentLink3Description: https://datasheet.ciiva.com/26847/getdatasheetpartid-408632-26847386.pdf?src-supplier=Verical; Dielectric: C0G; ComponentLink5URL: https://datasheet.ciiva.com/14586/70095383-14586671.pdf?src-supplier=Allied+Electronics; Manufacturer Part Number 1: C0402C270J5GACTU; ComponentLink2Description: https://datasheet.ciiva.com/7747/kem-c1003-c0g-smd-7747509.pdf?src-supplier=Element14; ComponentLink3URL: https://datasheet.ciiva.com/26847/getdatasheetpartid-408632-26847386.pdf?src-supplier=Verical; ComponentLink1Description: https://datasheet.ciiva.com/144/docfinderpartnumber-c0402c270j5gactu-144118.pdf?src-supplier=Digi-Key; Depth: 0.5mm
D1 D4 D5 = CMP-111-000004-2: LED GREEN DIFFUSED 0603 SMD Green 572nm LED Indication - Discrete 2.2V 0603 (1608 Metric); Manufacturer 1: Rohm; Forward Current: 20mA; Color: Green,Yellow; Min Operating Temperature: -40°C; Forward Voltage: 2.2V; Max Operating Temperature: 85°C; Case/Package: 0603; Manufacturer Part Number 1: SML-D12M8WT86
L1 = CMP-006-00079-1: Inductor Power Chip Wirewound 2.2uH 20% 100KHz Ferrite 1.6A 0.078Ohm DCR 1210 T/R; Manufacturer 1: Taiyo Yuden; Saturation Current: 1.85A; Self Resonant Frequency: 150MHz; Tolerance: 20%; Case/Package: Nonstandard; Manufacturer Part Number 1: BRL3225T2R2M; Current Rating: 1.6A
Q3 = CMP-074-000000-4: TRANS PREBIAS NPN 200MW SOT23-3; Manufacturer 1: Diodes; Max Drain to Source Voltage: 50V; Manufacturer Part Number 1: DDTC114YCA-7-F; Case/Package: SOT-23-3; Design Item ID: DDTC114YCA-7-F
R8 R9 = CMP-013-000012-8: RES SMD 22 OHM 1% 1/16W 0402; Manufacturer 1: Yageo; Power Rating: 62.5mW; Min Operating Temperature: -55°C; Tolerance: 1%; Design Item ID: RC0402FR-0722RL; Manufacturer Part Number 1: RC0402FR-0722RL; Max Operating Temperature: 155°C
R28 R36 = CMP-115-000016-6: RES SMD 49.9 OHM 1% 1/16W 0402; Manufacturer 1: Yageo; Temperature Coefficient: 100ppm/°C; Voltage Rating: 50V; Power Rating: 62.5mW; Design Item ID: RC0402FR-0749R9L; Min Operating Temperature: -55°C; Max Operating Temperature: 155°C; Tolerance: 1%; Manufacturer Part Number 1: RC0402FR-0749R9L
R37-R41 = CMP-115-000004-8: as R11 on sheet CONNECTOR_B; Min Operating Temperature: -55°C; Max Operating Temperature: 155°C; Design Item ID: RC0402FR-1310KL; Tolerance: 1%; Manufacturer Part Number 1: RC0402FR-1310KL
R42 = CMP-013-000005-8: RES SMD 1M OHM 1% 1/16W 0402; Manufacturer 1: Yageo; Power Rating: 63mW; Voltage Rating: 50V; Tolerance: 1%; Min Operating Temperature: -55°C; Manufacturer Part Number 1: RC0402FR-071ML; Design Item ID: RC0402FR-071ML; Max Operating Temperature: 155°C
R43 = CMP-115-000015-6: RES SMD 2.49K OHM 1% 1/16W 0402; Manufacturer 1: Yageo; Temperature Coefficient: 100ppm/°C; Power Rating: 62.5mW; Voltage Rating: 50V; Max Operating Temperature: 155°C; Min Operating Temperature: -55°C; Manufacturer Part Number 1: RC0402FR-072K49L; Tolerance: 1%; Design Item ID: RC0402FR-072K49L
R44 R77 R80 = CMP-013-000029-9: RES SMD 470 OHM 1% 1/16W 0402; Manufacturer 1: Vishay; Voltage Rating: 50V; Power Rating: 63mW; Max Operating Temperature: 155°C; Min Operating Temperature: -55°C; Tolerance: 1%; Design Item ID: CRCW0402470RFKED; Manufacturer Part Number 1: CRCW0402470RFKED
U2 = CMP-113-000000-3: IC ETHERNET/PCIe PHY Realtek; Manufacturer Part Number 1: RTL8111HS-CG; Manufacturer 1: Realtek
U7 = CMP-113-000005-2: TEXAS INSTRUMENTS - TXS0102DCUR - IC, TRANSLATOR, 2 BIT, BI, US-8; Max Supply Voltage: 5.5V; Max Output Current: 1A; Min Supply Voltage: 1.65V; Max Operating Temperature: 85°C; Pins: 8; Manufacturer 1: Texas Instruments; Manufacturer Part Number 1: TXS0102DCUR; Case/Package: VSSOP; Min Operating Temperature: -40°C
X1 = CMP-006-000002-2: CRYSTAL 25.0000MHZ 18PF SMD 25MHz ±10ppm Crystal 18pF 50 Ohms 4-SMD, No Lead; Manufacturer 1: ECS International; Manufacturer Part Number 1: ECS-250-18-36B-CKY-TR